# Altium project Graviton.PrjPcb (part 2 of 3)

## Sheet ifamp-rx.SchDoc: RX IF Amp
size Letter; CheckedBy: J. Brinton; CompanyName: Signal Laboratories, Inc.; DrawnBy: J. Brinton; Engineer: J. Brinton; Address1: 3479 Edison Way; Address2: Menlo Park CA 94025; Address3: +1 (877) 778-8435; Address4: siglabs.com; Revision: 3; SheetNumber: 12; SheetTotal: 49
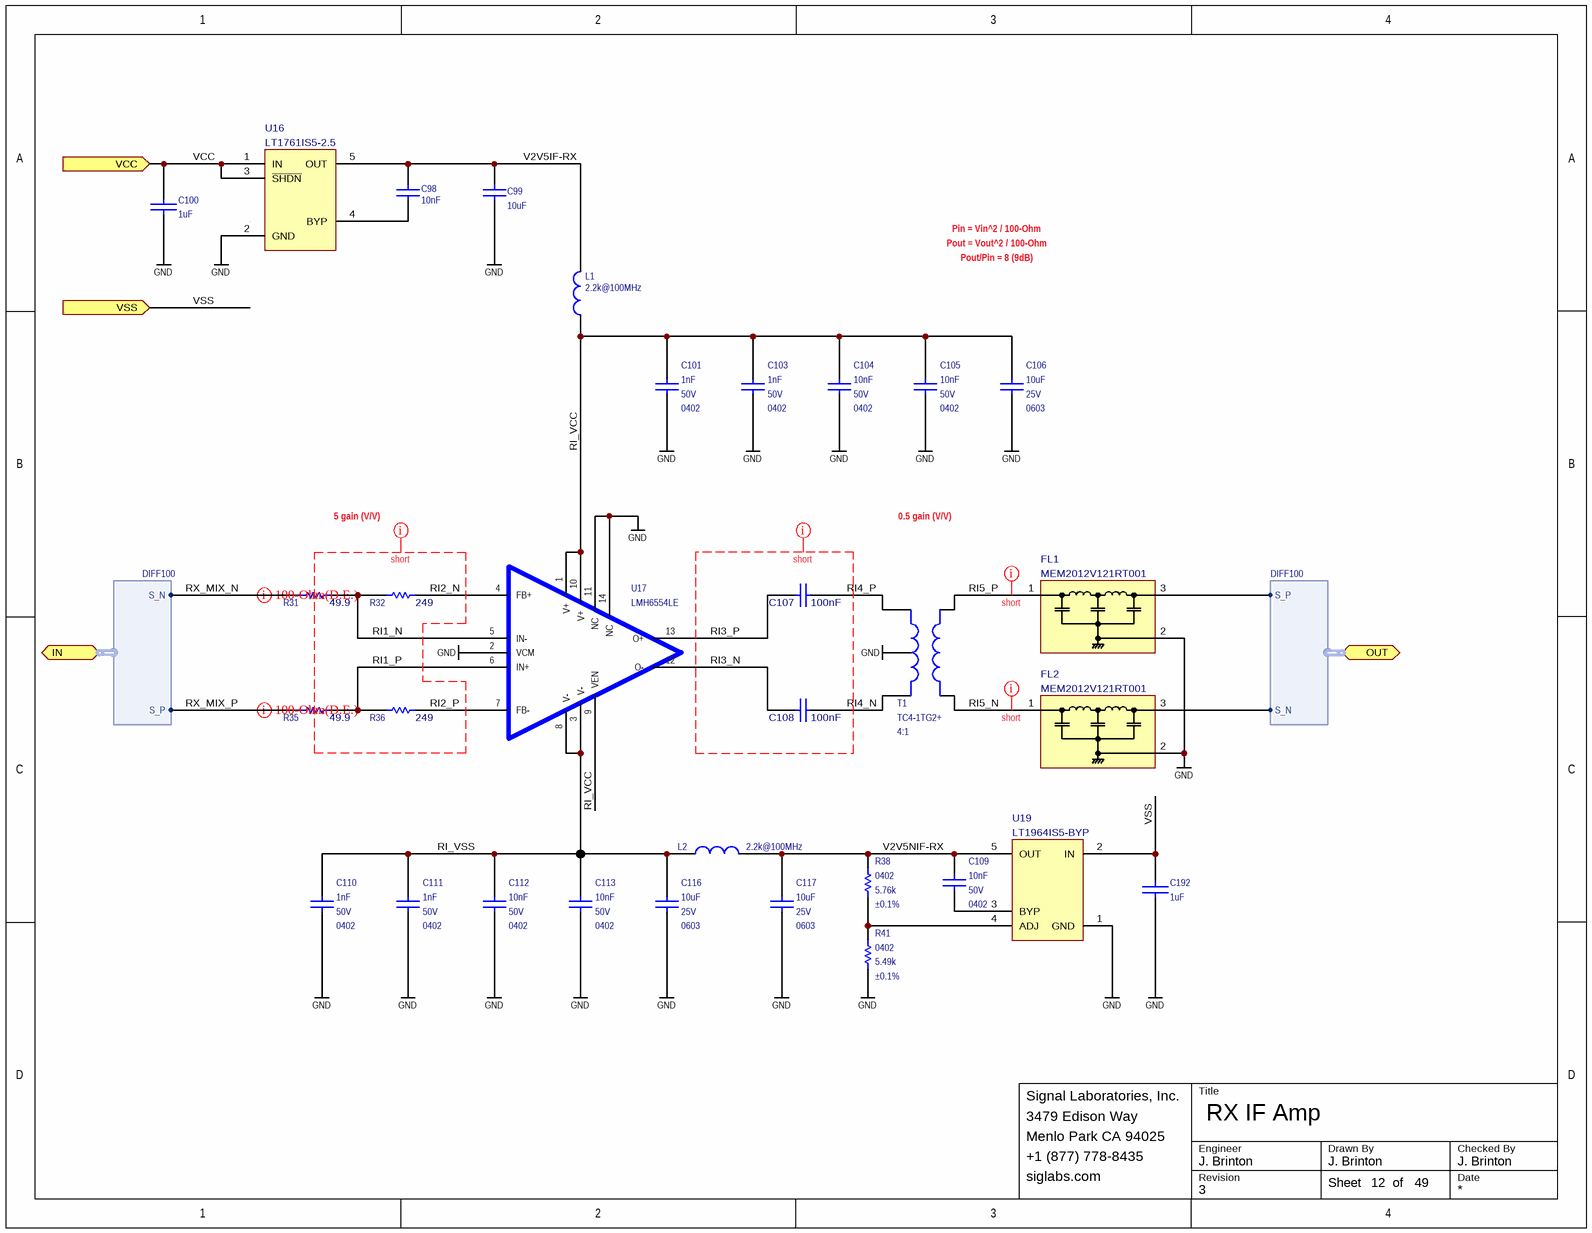
[diagram p7: ifamp-rx.SchDoc]

### Parts
C98  value 10nF  [CAPC100X50X55L25N]  (hidden comment: GRM155R71H103KA88)
C99  value 10uF  [CAPC160X80X90L20N]  (hidden comment: ZRB18AR61E106ME01L)
C100  value 1uF  [CAPC100X50X55L25N]  (hidden comment: GRM155R61A105KE15)
C101  value 1nF  Voltage: 50V  Package: 0402  [CAPC100X50X55L25N]  (hidden comment: CGA2B2NP01H102J050BA)
C103  value 1nF  Voltage: 50V  Package: 0402  [CAPC100X50X55L25N]  (hidden comment: CGA2B2NP01H102J050BA)
C104  value 10nF  Voltage: 50V  Package: 0402  [CAPC100X50X55L25N]  (hidden comment: GRM155R71H103KA88)
C105  value 10nF  Voltage: 50V  Package: 0402  [CAPC100X50X55L25N]  (hidden comment: GRM155R71H103KA88)
C106  value 10uF  Voltage: 25V  Package: 0603  [CAPC160X80X90L20N]  (hidden comment: ZRB18AR61E106ME01L)
C107  value 100nF  [CAPC100X50X55L25N]  (hidden comment: CC0402KRX7R8BB104)
C108  value 100nF  [CAPC100X50X55L25N]  (hidden comment: CC0402KRX7R8BB104)
C109  value 10nF  Voltage: 50V  Package: 0402  [CAPC100X50X55L25N]  (hidden comment: GRM155R71H103KA88)
C110  value 1nF  Voltage: 50V  Package: 0402  [CAPC100X50X55L25N]  (hidden comment: CGA2B2NP01H102J050BA)
C111  value 1nF  Voltage: 50V  Package: 0402  [CAPC100X50X55L25N]  (hidden comment: CGA2B2NP01H102J050BA)
C112  value 10nF  Voltage: 50V  Package: 0402  [CAPC100X50X55L25N]  (hidden comment: GRM155R71H103KA88)
C113  value 10nF  Voltage: 50V  Package: 0402  [CAPC100X50X55L25N]  (hidden comment: GRM155R71H103KA88)
C116  value 10uF  Voltage: 25V  Package: 0603  [CAPC160X80X90L20N]  (hidden comment: ZRB18AR61E106ME01L)
C117  value 10uF  Voltage: 25V  Package: 0603  [CAPC160X80X90L20N]  (hidden comment: ZRB18AR61E106ME01L)
C192  value 1uF  [CAPC100X50X55L25N]  (hidden comment: GRM155R61A105KE15)
FL1  MEM2012V121RT001  [MEM2012V]
FL2  MEM2012V121RT001  [MEM2012V]
L1  value 2.2k@100MHz  [INDC1005X55N]  (hidden comment: MMZ1005A222ET000)
L2  value 2.2k@100MHz  [INDC1005X55N]  (hidden comment: MMZ1005A222ET000)
R31  value 49.9  [RESC1608X55N]  (hidden comment: MCT0603PD4999DP500)
R32  value 249  [RESC1005X40N]  (hidden comment: MCS0402MD2490BE100)
R35  value 49.9  [RESC1608X55N]  (hidden comment: MCT0603PD4999DP500)
R36  value 249  [RESC1005X40N]  (hidden comment: MCS0402MD2490BE100)
R38  value 5.76k  Tolerance: ±0.1%  Package: 0402  [RESC1005X40N]  (hidden comment: RT0402BRE075K76L)
R41  value 5.49k  Tolerance: ±0.1%  Package: 0402  [RESC1005X40N]  (hidden comment: ERA-2AEB5491X)
T1  value 4:1  [AT224-1A]  (hidden comment: TC4-1TG2+)
U16  LT1761IS5-2.5  [TSOT-5]
U17  LMH6554LE  [NHJ0014A]
U19  LT1964IS5-BYP  [SOT23-5]

### Ports
IN (harness DIFF100), OUT (harness DIFF100), VCC (in), VSS (in)

### Harnesses
DIFF100: S_P, S_N

### Nets
GND: C99.1 C100.1 C101.1 C103.1 C104.1 C105.1 C106.1 C110.1 C111.1 C112.1 C113.1 C116.1 C117.1 C192.1 FL1.2(GND) FL2.2(GND) R41.1 T1.2(SecCT) U16.2(GND) U17.2(VCM) U17.11(NC) U17.14(NC) U19.1(GND)
RI1_N: R31.2 R32.1 U17.5(IN-)  [project net RI1_N_12]
RI1_P: R35.2 R36.1 U17.6(IN+)  [project net RI1_P_12]
RI2_N: R32.2 U17.4(FB+)  [project net RI2_N_12]
RI2_P: R36.2 U17.7(FB-)  [project net RI2_P_12]
RI3_N: C108.1 U17.12(O-)  [project net RI3_N_12]
RI3_P: C107.1 U17.13(O+)  [project net RI3_P_12]
RI4_N: C108.2 T1.1(Sec+)  [project net RI4_N_12]
RI4_P: C107.2 T1.3(Sec-)  [project net RI4_P_12]
RI5_N: FL2.1(IN/OUT) T1.6(Pri+)  [project net RI5_N_12]
RI5_P: FL1.1(IN/OUT) T1.4(Pri-)  [project net RI5_P_12]
RI_VCC: C101.2 C103.2 C104.2 C105.2 C106.2 L1.1 U17.1(V+) U17.9(VEN) U17.10(V+)  [project net RI_VCC_12]
RI_VSS: C110.2 C111.2 C112.2 C113.2 C116.2 L2.1 U17.3(V-) U17.8(V-)  [project net RI_VSS_12]
RX_MIX_N: R31.1 ; port IN.S_N
RX_MIX_P: R35.1 ; port IN.S_P
V2V5IF-RX: C98.2 C99.2 L1.2 U16.5(OUT)  [project net V2V5IF-RX_12]
V2V5NIF-RX: C109.2 C117.2 L2.2 R38.2 U19.5(OUT)  [project net V2V5NIF-RX_12]
VCC: C100.2 U16.1(IN) U16.3(~{SHDN}) ; port VCC
VSS: C192.2 U19.2(IN) ; port VSS
NetC98_1: C98.1 U16.4(BYP)
NetC109_1: C109.1 U19.3(BYP)
NetFL1_3: FL1.3(OUT/IN) ; port OUT.S_P
NetFL2_3: FL2.3(OUT/IN) ; port OUT.S_N
NetR38_1: R38.1 R41.2 U19.4(ADJ)

### Layout directives
net class short: RI1_N, RI1_P, RI2_N, RI2_P, RI3_N, RI3_P, RI4_N, RI4_P, RI5_N_12, RI5_P_12
differential pair; net class z100diff12; Name: 100-Ohm(D.E.): RX_MIX_N, RX_MIX_P

### Notes on the sheet
- Pin = Vin^2 / 100-Ohm
- Pout = Vout^2 / 100-Ohm
- Pout/Pin = 8 (9dB)
- 5 gain (V/V)
- 0.5 gain (V/V)
- Title
- Engineer
- Revision
- Drawn By
- Checked By
- Date
- Sheet
- of

### Library data of the parts
C98 C104 C105 C109 C112 C113 = CAP 0402: as C522 on sheet eth; Manufacturer P/N: GRM155R71H103KA88; Tolerance: ±10%
  C98: Voltage: 50V; Package: 0402
C99 C106 C116 C117 = CAP 0603: Ceramic Capacitor 10uF ±20% 25V X5R 0603; Manufacturer: Murata; Tr: -55:85; Manufacturer P/N: ZRB18AR61E106ME01L; Tolerance: ±20%
  C99: Voltage: 25V; Package: 0603
C100 C192 = CAP: Ceramic Capacitor 1uF ±10% 10V X5R 0402; Manufacturer: Murata; Tr: -55:125; Manufacturer P/N: GRM155R61A105KE15; Package: 0402; Tolerance: ±10%; Voltage: 10V
C101 C103 C110 C111 = CAP 0402: as C545 on sheet eth; Manufacturer P/N: CGA2B2NP01H102J050BA; Tolerance: ±5%
C107 C108 = TMK105B7104KV: Ceramic Capacitor 100nF ±10% 25V X7R 0402; Manufacturer: Yageo; Manufacturer P/N: TMK105B7104KV; Tolerance: ±10%; Tr: *; Package: 0402; Voltage: 25V
FL1 FL2 = MEM2012V121RT001: MEM2012 Series 120 MHz 10V 100mA SMT Signal Line 3-Terminal Filter; Manufacturer: TDK; Package: MEM2012V; Manufacturer P/N: MEM2012V121RT001
L1 L2 = INDUCTANCE1: Ferrite Bead 2.2k@100MHz 150mA 0402; Manufacturer: TDK; Tr: -55:125; Manufacturer P/N: MMZ1005A222ET000; Package: 0402
R31 R35 = RES 0603: Thin Film Resistor 49.9 Ohm ±0.5% 0603; Manufacturer: Vishay; Tr: -55:155; Package: 0603; Manufacturer P/N: MCT0603PD4999DP500; Do Not Place: *; Tolerance: ±0.5%
R32 R36 = RES 0603: Thin Film Resistor 249 Ohm ±0.1% 0402; Manufacturer: Vishay; Tr: -55:155; Package: 0402; Manufacturer P/N: MCS0402MD2490BE100; Do Not Place: *; Tolerance: ±0.1%
R38 = RES: Thin Film Resistor 5.76k +/-0.1% SMD 0402; Manufacturer: Yageo; Tr: -55:155; Tcr: *; Manufacturer P/N: RT0402BRE075K76L; Alternatives: *; Voltage: *; Power: *
R41 = RES: Thin Film Resistor 5.49k +/-0.1% SMD 0402; Manufacturer: Panasonic; Tr: -55:155; Tcr: *; Manufacturer P/N: ERA-2AEB5491X; Alternatives: *; Voltage: *; Power: *
T1 = TC1-1TG2+: RF Transformer 0.5 to 300MHz SMD; Manufacturer: Mini-Circuits; Manufacturer P/N: TC4-1TG2+
U16 = LT1761IS5-5: 100mA Low Noise LDO 5V; Manufacturer: Linear Technology; Manufacturer P/N: LT1761IS5-5
U17 = LMH6554LE: 2.8 GHz Ultra Linear Fully Differential Amplifier; Manufacturer: Texas Instruments; Manufacturer P/N: LMH6554LE
U19 = LT1964IS5-BYP: 200mA Low Noise negative-LDO; Manufacturer: Linear Technology; Manufacturer P/N: LT1964IS5-BYP

## Sheet dac.SchDoc: DAC
size Letter; CheckedBy: J. Brinton; CompanyName: Signal Laboratories, Inc.; DrawnBy: J. Brinton; Engineer: J. Brinton; Address1: 3479 Edison Way; Address2: Menlo Park CA 94025; Address3: +1 (877) 778-8435; Address4: siglabs.com; Revision: 3; SheetNumber: 24; SheetTotal: 49; ModifiedDate: 4/20/2018
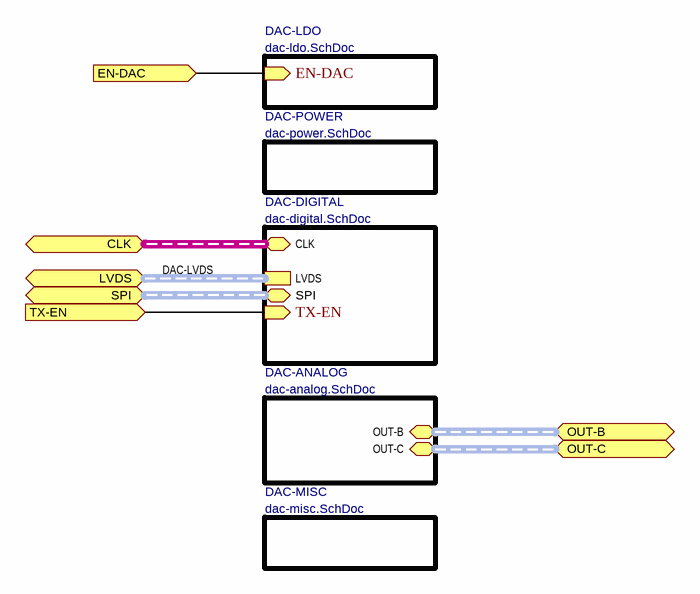
[diagram p8: dac.SchDoc]

### Sub-sheets
DAC-ANALOG = dac-analog.SchDoc: OUT-B (harness DIFF100), OUT-C (harness DIFF100)
DAC-DIGITAL = dac-digital.SchDoc: LVDS (harness DAC-LVDS), CLK (harness CLK-LVPECL33-TERM), SPI (harness SPI-3V3), TX-EN (in)
DAC-LDO = dac-ldo.SchDoc: EN-DAC (in)
DAC-MISC = dac-misc.SchDoc: no entries
DAC-POWER = dac-power.SchDoc: no entries

### Ports
CLK (harness CLK-LVPECL33-TERM), EN-DAC (in), LVDS (harness DAC-LVDS), OUT-B (harness DIFF100), OUT-C (harness DIFF100), SPI (harness SPI-3V3), TX-EN (in)

### Nets
EN-DAC: port EN-DAC, sheet DAC-LDO/EN-DAC
NetTP4_1: port TX-EN, sheet DAC-DIGITAL/TX-EN

### Buses and harness runs
harness DAC-LVDS = port LVDS = sheet DAC-DIGITAL/LVDS
harness port CLK = sheet DAC-DIGITAL/CLK
harness port OUT-B = sheet DAC-ANALOG/OUT-B
harness port OUT-C = sheet DAC-ANALOG/OUT-C
harness port SPI = sheet DAC-DIGITAL/SPI

### Notes on the sheet
- Title
- Engineer
- Revision
- Drawn By
- Checked By
- Date
- Sheet
- of

## Sheet dac-digital.SchDoc: DAC - Digital
size Letter; CheckedBy: J. Brinton; CompanyName: Signal Laboratories, Inc.; DrawnBy: J. Brinton; Engineer: J. Brinton; Address1: 3479 Edison Way; Address2: Menlo Park CA 94025; Address3: +1 (877) 778-8435; Address4: siglabs.com; Revision: 3; SheetNumber: 25; SheetTotal: 49
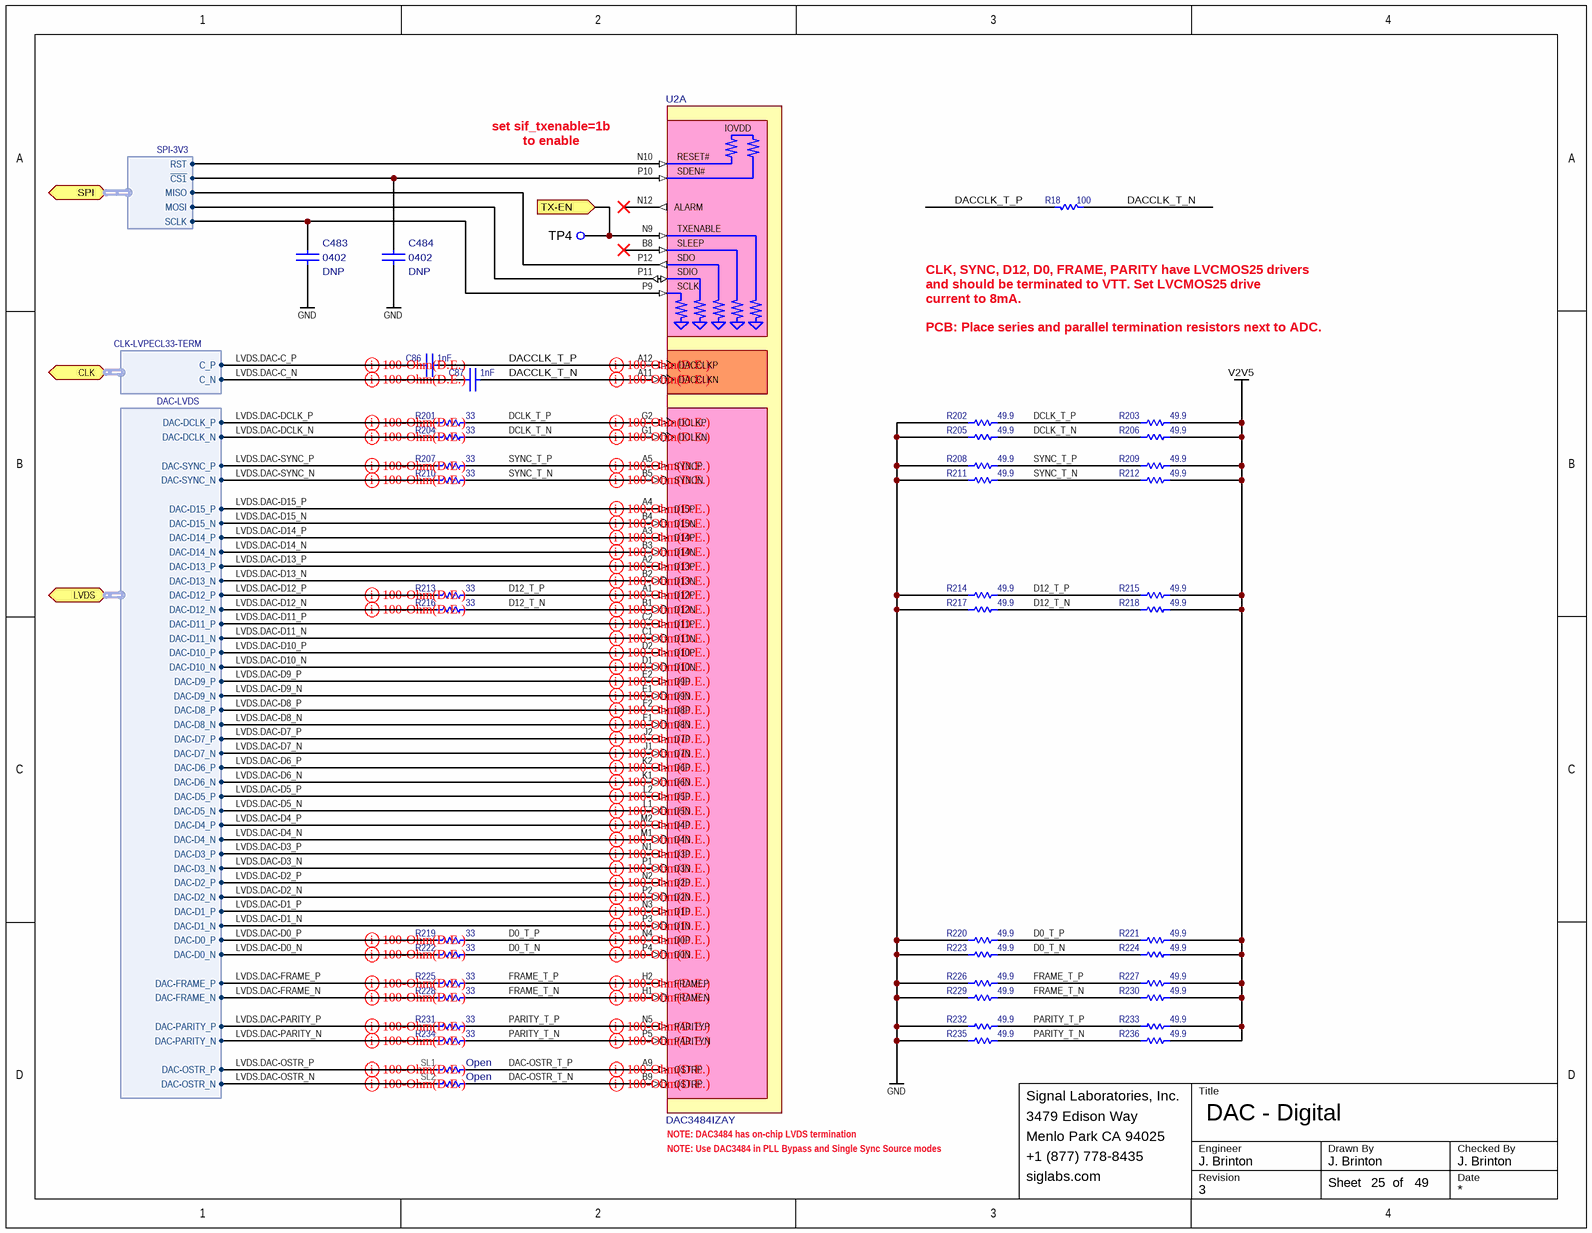
[diagram p9: dac-digital.SchDoc]

### Parts
C86  value 1nF  [CAPC100X50X55L25N]  (hidden comment: CGA2B2NP01H102J050BA)
C87  value 1nF  [CAPC100X50X55L25N]  (hidden comment: CGA2B2NP01H102J050BA)
C483  Package: 0402  Do Not Place: DNP  [CAPC100X50X55L25N]  (hidden comment: VJ0402A101KXA)
C484  Package: 0402  Do Not Place: DNP  [CAPC100X50X55L25N]  (hidden comment: VJ0402A101KXA)
R18  value 100  [RESC1005X40N]  (hidden comment: ERA-2AEB101X)
R201  value 33  [RESC1005X40N]  (hidden comment: MCS04020C3309FE000)
R202  value 49.9  [RESC1005X40N]  (hidden comment: MCS04020C4999FE000)
R203  value 49.9  [RESC1005X40N]  (hidden comment: MCS04020C4999FE000)
R204  value 33  [RESC1005X40N]  (hidden comment: MCS04020C3309FE000)
R205  value 49.9  [RESC1005X40N]  (hidden comment: MCS04020C4999FE000)
R206  value 49.9  [RESC1005X40N]  (hidden comment: MCS04020C4999FE000)
R207  value 33  [RESC1005X40N]  (hidden comment: MCS04020C3309FE000)
R208  value 49.9  [RESC1005X40N]  (hidden comment: MCS04020C4999FE000)
R209  value 49.9  [RESC1005X40N]  (hidden comment: MCS04020C4999FE000)
R210  value 33  [RESC1005X40N]  (hidden comment: MCS04020C3309FE000)
R211  value 49.9  [RESC1005X40N]  (hidden comment: MCS04020C4999FE000)
R212  value 49.9  [RESC1005X40N]  (hidden comment: MCS04020C4999FE000)
R213  value 33  [RESC1005X40N]  (hidden comment: MCS04020C3309FE000)
R214  value 49.9  [RESC1005X40N]  (hidden comment: MCS04020C4999FE000)
R215  value 49.9  [RESC1005X40N]  (hidden comment: MCS04020C4999FE000)
R216  value 33  [RESC1005X40N]  (hidden comment: MCS04020C3309FE000)
R217  value 49.9  [RESC1005X40N]  (hidden comment: MCS04020C4999FE000)
R218  value 49.9  [RESC1005X40N]  (hidden comment: MCS04020C4999FE000)
R219  value 33  [RESC1005X40N]  (hidden comment: MCS04020C3309FE000)
R220  value 49.9  [RESC1005X40N]  (hidden comment: MCS04020C4999FE000)
R221  value 49.9  [RESC1005X40N]  (hidden comment: MCS04020C4999FE000)
R222  value 33  [RESC1005X40N]  (hidden comment: MCS04020C3309FE000)
R223  value 49.9  [RESC1005X40N]  (hidden comment: MCS04020C4999FE000)
R224  value 49.9  [RESC1005X40N]  (hidden comment: MCS04020C4999FE000)
R225  value 33  [RESC1005X40N]  (hidden comment: MCS04020C3309FE000)
R226  value 49.9  [RESC1005X40N]  (hidden comment: MCS04020C4999FE000)
R227  value 49.9  [RESC1005X40N]  (hidden comment: MCS04020C4999FE000)
R228  value 33  [RESC1005X40N]  (hidden comment: MCS04020C3309FE000)
R229  value 49.9  [RESC1005X40N]  (hidden comment: MCS04020C4999FE000)
R230  value 49.9  [RESC1005X40N]  (hidden comment: MCS04020C4999FE000)
R231  value 33  [RESC1005X40N]  (hidden comment: MCS04020C3309FE000)
R232  value 49.9  [RESC1005X40N]  (hidden comment: MCS04020C4999FE000)
R233  value 49.9  [RESC1005X40N]  (hidden comment: MCS04020C4999FE000)
R234  value 33  [RESC1005X40N]  (hidden comment: MCS04020C3309FE000)
R235  value 49.9  [RESC1005X40N]  (hidden comment: MCS04020C4999FE000)
R236  value 49.9  [RESC1005X40N]  (hidden comment: MCS04020C4999FE000)
SL1  Notes: Open  [SOLDERLINK0603X26N]  (hidden comment: SOLDER_LINK)  (no BOM)
SL2  Notes: Open  [SOLDERLINK0603X26N]  (hidden comment: SOLDER_LINK)  (no BOM)
TP4  TEST_POINT_SMD_10  [TEST_POINT_SMD_10]  (value not drawn)  (no BOM)
U2  DAC3484IZAY  [ZAY-BGA-196]  (part A of 5)

### Ports
CLK (harness CLK-LVPECL33-TERM), LVDS (harness DAC-LVDS), SPI (harness SPI-3V3), TX-EN (in)

### Harnesses
DAC-LVDS: DAC-D0_P, DAC-D0_N, DAC-D1_P, DAC-D1_N, DAC-D2_P, DAC-D2_N, DAC-D3_P, DAC-D3_N, DAC-D4_P, DAC-D4_N, DAC-D5_P, DAC-D5_N, DAC-D6_P, DAC-D6_N, DAC-D7_P, DAC-D7_N, DAC-D8_P, DAC-D8_N, DAC-D9_P, DAC-D9_N, DAC-D10_P, DAC-D10_N, DAC-D11_P, DAC-D11_N, DAC-D12_P, DAC-D12_N, DAC-D13_P, DAC-D13_N, DAC-D14_P, DAC-D14_N, DAC-D15_P, DAC-D15_N, DAC-DCLK_P, DAC-DCLK_N, DAC-SYNC_P, DAC-SYNC_N, DAC-PARITY_P, DAC-PARITY_N, DAC-FRAME_P, DAC-FRAME_N, DAC-OSTR_P, DAC-OSTR_N
CLK-LVPECL33-TERM: C_P, C_N
SPI-3V3: MOSI, MISO, SCLK, ~{CS1}, RST

### Nets
GND: C483.2 C484.2 R202.2 R205.2 R208.2 R211.2 R214.2 R217.2 R220.2 R223.2 R226.2 R229.2 R232.2 R235.2
V2V5: R203.1 R206.1 R209.1 R212.1 R215.1 R218.1 R221.1 R224.1 R227.1 R230.1 R233.1 R236.1
D0_T_N: R222.1 R223.1 R224.2 U2.P4(D0N)  [project net D0_T_N_25]
D0_T_P: R219.1 R220.1 R221.2 U2.N4(D0P)  [project net D0_T_P_25]
D12_T_N: R216.1 R217.1 R218.2 U2.B1(D12N)  [project net D12_T_N_25]
D12_T_P: R213.1 R214.1 R215.2 U2.A1(D12P)  [project net D12_T_P_25]
DAC-OSTR_T_N: SL2.1 U2.B9(OSTRP)  [project net DAC-OSTR_T_N_25]
DAC-OSTR_T_P: SL1.1 U2.A9(OSTRP)  [project net DAC-OSTR_T_P_25]
DACCLK_T_N: C87.1 R18.2 U2.A11(DACCLKN)  [project net DACCLK_T_N_25]
DACCLK_T_P: C86.1 R18.1 U2.A12(DACCLKP)  [project net DACCLK_T_P_25]
DCLK_T_N: R204.1 R205.1 R206.2 U2.G1(DCLKN)  [project net DCLK_T_N_25]
DCLK_T_P: R201.1 R202.1 R203.2 U2.G2(DCLKP)  [project net DCLK_T_P_25]
FRAME_T_N: R228.1 R229.1 R230.2 U2.H1(FRAMEN)  [project net FRAME_T_N_25]
FRAME_T_P: R225.1 R226.1 R227.2 U2.H2(FRAMEP)  [project net FRAME_T_P_25]
LVDS.DAC-C_N: C87.2 ; port CLK.C_N
LVDS.DAC-C_P: C86.2 ; port CLK.C_P
LVDS.DAC-D0_N: R222.2 ; port LVDS.DAC-D0_N  [project net DAC-LVDS.DAC-D0_N]
LVDS.DAC-D0_P: R219.2 ; port LVDS.DAC-D0_P  [project net DAC-LVDS.DAC-D0_P]
LVDS.DAC-D1_N: U2.P3(D1N) ; port LVDS.DAC-D1_N  [project net DAC-LVDS.DAC-D1_N]
LVDS.DAC-D1_P: U2.N3(D1P) ; port LVDS.DAC-D1_P  [project net DAC-LVDS.DAC-D1_P]
LVDS.DAC-D2_N: U2.P2(D2N) ; port LVDS.DAC-D2_N  [project net DAC-LVDS.DAC-D2_N]
LVDS.DAC-D2_P: U2.N2(D2P) ; port LVDS.DAC-D2_P  [project net DAC-LVDS.DAC-D2_P]
LVDS.DAC-D3_N: U2.P1(D3N) ; port LVDS.DAC-D3_N  [project net DAC-LVDS.DAC-D3_N]
LVDS.DAC-D3_P: U2.N1(D3P) ; port LVDS.DAC-D3_P  [project net DAC-LVDS.DAC-D3_P]
LVDS.DAC-D4_N: U2.M1(D4N) ; port LVDS.DAC-D4_N  [project net DAC-LVDS.DAC-D4_N]
LVDS.DAC-D4_P: U2.M2(D4P) ; port LVDS.DAC-D4_P  [project net DAC-LVDS.DAC-D4_P]
LVDS.DAC-D5_N: U2.L1(D5N) ; port LVDS.DAC-D5_N  [project net DAC-LVDS.DAC-D5_N]
LVDS.DAC-D5_P: U2.L2(D5P) ; port LVDS.DAC-D5_P  [project net DAC-LVDS.DAC-D5_P]
LVDS.DAC-D6_N: U2.K1(D6N) ; port LVDS.DAC-D6_N  [project net DAC-LVDS.DAC-D6_N]
LVDS.DAC-D6_P: U2.K2(D6P) ; port LVDS.DAC-D6_P  [project net DAC-LVDS.DAC-D6_P]
LVDS.DAC-D7_N: U2.J1(D7N) ; port LVDS.DAC-D7_N  [project net DAC-LVDS.DAC-D7_N]
LVDS.DAC-D7_P: U2.J2(D7P) ; port LVDS.DAC-D7_P  [project net DAC-LVDS.DAC-D7_P]
LVDS.DAC-D8_N: U2.F1(D8N) ; port LVDS.DAC-D8_N  [project net DAC-LVDS.DAC-D8_N]
LVDS.DAC-D8_P: U2.F2(D8P) ; port LVDS.DAC-D8_P  [project net DAC-LVDS.DAC-D8_P]
LVDS.DAC-D9_N: U2.E1(D9N) ; port LVDS.DAC-D9_N  [project net DAC-LVDS.DAC-D9_N]
LVDS.DAC-D9_P: U2.E2(D9P) ; port LVDS.DAC-D9_P  [project net DAC-LVDS.DAC-D9_P]
LVDS.DAC-D10_N: U2.D1(D10N) ; port LVDS.DAC-D10_N  [project net DAC-LVDS.DAC-D10_N]
LVDS.DAC-D10_P: U2.D2(D10P) ; port LVDS.DAC-D10_P  [project net DAC-LVDS.DAC-D10_P]
LVDS.DAC-D11_N: U2.C1(D11N) ; port LVDS.DAC-D11_N  [project net DAC-LVDS.DAC-D11_N]
LVDS.DAC-D11_P: U2.C2(D11P) ; port LVDS.DAC-D11_P  [project net DAC-LVDS.DAC-D11_P]
LVDS.DAC-D12_N: R216.2 ; port LVDS.DAC-D12_N  [project net DAC-LVDS.DAC-D12_N]
LVDS.DAC-D12_P: R213.2 ; port LVDS.DAC-D12_P  [project net DAC-LVDS.DAC-D12_P]
LVDS.DAC-D13_N: U2.B2(D13N) ; port LVDS.DAC-D13_N  [project net DAC-LVDS.DAC-D13_N]
LVDS.DAC-D13_P: U2.A2(D13P) ; port LVDS.DAC-D13_P  [project net DAC-LVDS.DAC-D13_P]
LVDS.DAC-D14_N: U2.B3(D14N) ; port LVDS.DAC-D14_N  [project net DAC-LVDS.DAC-D14_N]
LVDS.DAC-D14_P: U2.A3(D14P) ; port LVDS.DAC-D14_P  [project net DAC-LVDS.DAC-D14_P]
LVDS.DAC-D15_N: U2.B4(D15N) ; port LVDS.DAC-D15_N  [project net DAC-LVDS.DAC-D15_N]
LVDS.DAC-D15_P: U2.A4(D15P) ; port LVDS.DAC-D15_P  [project net DAC-LVDS.DAC-D15_P]
LVDS.DAC-DCLK_N: R204.2 ; port LVDS.DAC-DCLK_N  [project net DAC-LVDS.DAC-DCLK_N]
LVDS.DAC-DCLK_P: R201.2 ; port LVDS.DAC-DCLK_P  [project net DAC-LVDS.DAC-DCLK_P]
LVDS.DAC-FRAME_N: R228.2 ; port LVDS.DAC-FRAME_N  [project net DAC-LVDS.DAC-FRAME_N]
LVDS.DAC-FRAME_P: R225.2 ; port LVDS.DAC-FRAME_P  [project net DAC-LVDS.DAC-FRAME_P]
LVDS.DAC-OSTR_N: SL2.2 ; port LVDS.DAC-OSTR_N  [project net DAC-LVDS.DAC-OSTR_N]
LVDS.DAC-OSTR_P: SL1.2 ; port LVDS.DAC-OSTR_P  [project net DAC-LVDS.DAC-OSTR_P]
LVDS.DAC-PARITY_N: R234.2 ; port LVDS.DAC-PARITY_N  [project net DAC-LVDS.DAC-PARITY_N]
LVDS.DAC-PARITY_P: R231.2 ; port LVDS.DAC-PARITY_P  [project net DAC-LVDS.DAC-PARITY_P]
LVDS.DAC-SYNC_N: R210.2 ; port LVDS.DAC-SYNC_N  [project net DAC-LVDS.DAC-SYNC_N]
LVDS.DAC-SYNC_P: R207.2 ; port LVDS.DAC-SYNC_P  [project net DAC-LVDS.DAC-SYNC_P]
PARITY_T_N: R234.1 R235.1 R236.2 U2.P5(PARITYN)  [project net PARITY_T_N_25]
PARITY_T_P: R231.1 R232.1 R233.2 U2.N5(PARITYP)  [project net PARITY_T_P_25]
SYNC_T_N: R210.1 R211.1 R212.2 U2.B5(SYNCN)  [project net SYNC_T_N_25]
SYNC_T_P: R207.1 R208.1 R209.2 U2.A5(SYNCP)  [project net SYNC_T_P_25]
NetC483_1: C483.1 U2.P9(SCLK) ; port SPI.SCLK
NetC484_1: C484.1 U2.P10(~{SDEN}) ; port SPI.~{CS1}
NetTP4_1: TP4.1 U2.N9(TXENABLE) ; port TX-EN
NetU2_N10: U2.N10(~{RESET}) ; port SPI.RST
NetU2_P11: U2.P11(SDIO) ; port SPI.MOSI
NetU2_P12: U2.P12(SDO) ; port SPI.MISO

Not connected (* = marked no-connect by the designer): U2 B8(SLEEP)* N12(ALARM)*

### Layout directives
differential pair; net class z100diff12; Name: 100-Ohm(D.E.): D0_T_N_25, D0_T_P_25, D12_T_N_25, D12_T_P_25, DAC-LVDS.DAC-D13_N, DAC-LVDS.DAC-D13_P, DAC-LVDS.DAC-D14_N, DAC-LVDS.DAC-D14_P, DAC-LVDS.DAC-D15_N, DAC-LVDS.DAC-D15_P, DAC-OSTR_T_N_25, DAC-OSTR_T_P_25, DACCLK_T_N_25, DACCLK_T_P_25, DCLK_T_N_25, DCLK_T_P_25, FRAME_T_N_25, FRAME_T_P_25, LVDS.DAC-C_N, LVDS.DAC-C_P, PARITY_T_N_25, PARITY_T_P_25, SYNC_T_N_25, SYNC_T_P_25
differential pair; net class z100diff12; Name: 100-Ohm(D.E.); net class dac: DAC-LVDS.DAC-D0_N, DAC-LVDS.DAC-D0_P, DAC-LVDS.DAC-D1_N, DAC-LVDS.DAC-D1_P, DAC-LVDS.DAC-D2_N, DAC-LVDS.DAC-D2_P, DAC-LVDS.DAC-D3_N, DAC-LVDS.DAC-D3_P, DAC-LVDS.DAC-D4_N, DAC-LVDS.DAC-D4_P, DAC-LVDS.DAC-D5_N, DAC-LVDS.DAC-D5_P, DAC-LVDS.DAC-D6_N, DAC-LVDS.DAC-D6_P, DAC-LVDS.DAC-D7_N, DAC-LVDS.DAC-D7_P, DAC-LVDS.DAC-D8_N, DAC-LVDS.DAC-D8_P, DAC-LVDS.DAC-D9_N, DAC-LVDS.DAC-D9_P, DAC-LVDS.DAC-D10_N, DAC-LVDS.DAC-D10_P, DAC-LVDS.DAC-D11_N, DAC-LVDS.DAC-D11_P, DAC-LVDS.DAC-D12_N, DAC-LVDS.DAC-D12_P, DAC-LVDS.DAC-DCLK_N, DAC-LVDS.DAC-DCLK_P, DAC-LVDS.DAC-FRAME_N, DAC-LVDS.DAC-FRAME_P, DAC-LVDS.DAC-OSTR_N, DAC-LVDS.DAC-OSTR_P, DAC-LVDS.DAC-PARITY_N, DAC-LVDS.DAC-PARITY_P, DAC-LVDS.DAC-SYNC_N, DAC-LVDS.DAC-SYNC_P

### Notes on the sheet
- set sif_txenable=1b
- to enable
- CLK, SYNC, D12, D0, FRAME, PARITY have LVCMOS25 drivers
- and should be terminated to VTT. Set LVCMOS25 drive
- current to 8mA.
- PCB: Place series and parallel termination resistors next to ADC.
- (near U2) NOTE: DAC3484 has on-chip LVDS termination
- NOTE: Use DAC3484 in PLL Bypass and Single Sync Source modes
- Title
- Engineer
- Revision
- Drawn By
- Checked By
- Date
- Sheet
- of
- (in symbol DAC3484IZAY, part A) RESET#; SDEN#

### Library data of the parts
C86 C87 = CAP 0402: Ceramic Capacitor 1nF ±5% 50V NP0 0402; Manufacturer: TDK; Tr: -55:150; Voltage: 50V; Manufacturer P/N: CGA2B2NP01H102J050BA; Package: 0402; Tolerance: ±5%
C483 C484 = VJ0402A101JXA: Ceramic Capacitor 100pF ±10% 50V C0G 0402; Manufacturer: Vishay; Tr: -55:150; Manufacturer P/N: VJ0402A101KXA; Tolerance: ±10%; Value: 100pF; Voltage: 50V
R18 = RES 0402: Thin Film Resistor 100 ±0.1% 0402; Manufacturer: Panasonic; Tr: -55:155; Package: 0402; Manufacturer P/N: ERA-2AEB101X; Tolerance: ±0.1%
R201 R204 R207 R210 R213 R216 R219 R222 R225 R228 R231 R234 = RES 0603: Thin Film Resistor 33 Ohm ±1% 0402; Manufacturer: Vishay; Tr: -55:150; Package: 0402; Manufacturer P/N: MCS04020C3309FE000; Do Not Place: *; Tolerance: ±1%
R202 R203 R205 R206 R208 R209 R211 R212 R214 R215 R217 R218 R220 R221 R223 R224 R226 R227 R229 R230 R232 R233 R235 R236 = RES 0603: Thin Film Resistor 49.9 Ohm ±1% 0402; Manufacturer: Vishay; Tr: -55:150; Package: 0402; Manufacturer P/N: MCS04020C4999FE000; Do Not Place: *; Tolerance: ±1%
SL1 SL2 = RES: Solder Link, Open
TP4 = TEST_POINT_SMD_10: Test Point SMD
U2 = DAC3484IZAY: High Speed Quad DAC, 16-bit, 1.25GSPS; Manufacturer: Texas Instruments; Manufacturer P/N: DAC3484IZAY

## Sheet dac-analog.SchDoc: DAC - Analog
size Letter; CheckedBy: J. Brinton; CompanyName: Signal Laboratories, Inc.; DrawnBy: J. Brinton; Engineer: J. Brinton; Address1: 3479 Edison Way; Address2: Menlo Park CA 94025; Address3: +1 (877) 778-8435; Address4: siglabs.com; Revision: 3; SheetNumber: 26; SheetTotal: 49; ModifiedDate: 4/20/2018
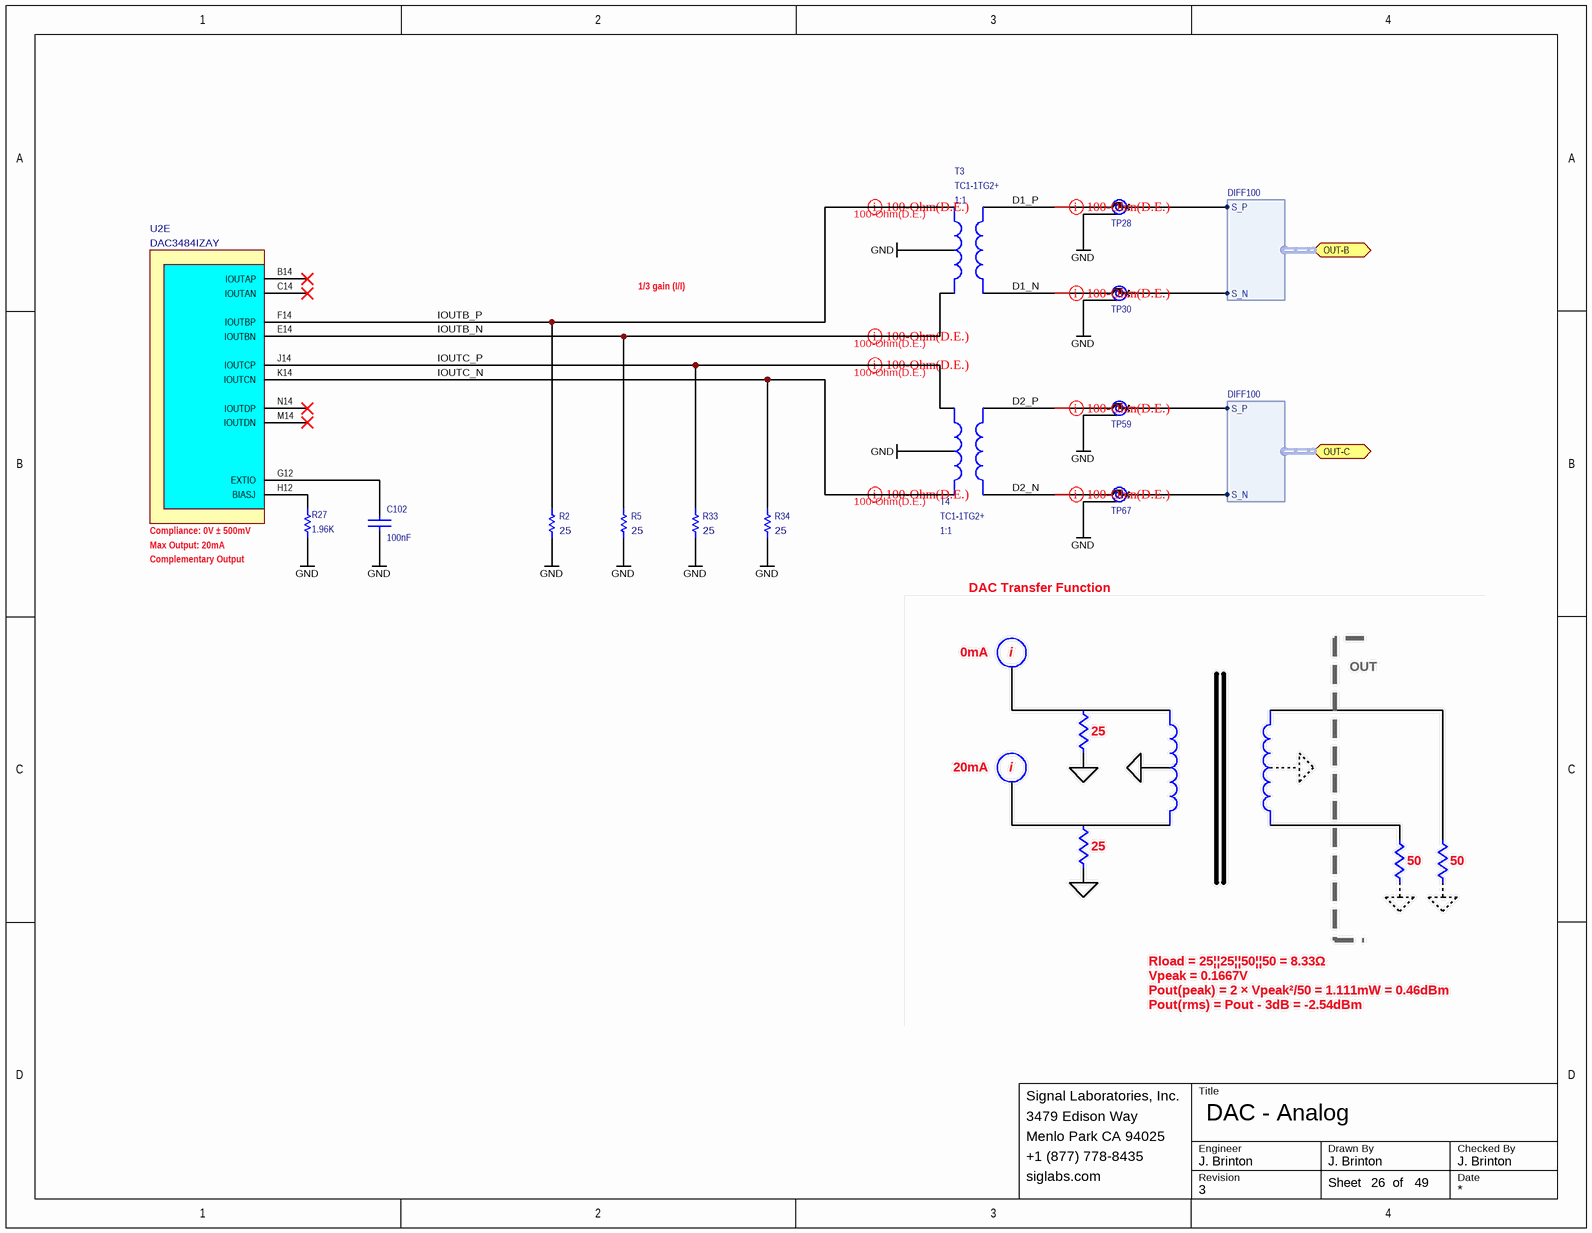
[diagram p10: dac-analog.SchDoc]

### Parts
C102  value 100nF  [CAPC100X50X55L25N]  (hidden comment: GRM155R71C104KA88J)
R2  value 25  [RESC1005X40N]  (hidden comment: FC0402E25R0BST0)
R5  value 25  [RESC1005X40N]  (hidden comment: FC0402E25R0BST0)
R27  value 1.96K  [RESC1005X40N]  (hidden comment: ERA-2AEB1961X)
R33  value 25  [RESC1005X40N]  (hidden comment: FC0402E25R0BST0)
R34  value 25  [RESC1005X40N]  (hidden comment: FC0402E25R0BST0)
T3  value 1:1  [AT224-1A]  (hidden comment: TC1-1TG2+)
T4  value 1:1  [AT224-1A]  (hidden comment: TC1-1TG2+)
TP28  MS-180(20)  [MS-180(20)]  (value not drawn)
TP30  MS-180(20)  [MS-180(20)]  (value not drawn)
TP59  MS-180(20)  [MS-180(20)]  (value not drawn)
TP67  MS-180(20)  [MS-180(20)]  (value not drawn)
U2  DAC3484IZAY  [ZAY-BGA-196]  (part E of 5)

### Ports
OUT-B (harness DIFF100), OUT-C (harness DIFF100)

### Harnesses
DIFF100: S_P, S_N

### Nets
GND: C102.1 R2.1 R5.1 R27.1 R33.1 R34.1 T3.2(SecCT) T4.2(SecCT) TP28.G(GND) TP30.G(GND) TP59.G(GND) TP67.G(GND)
D1_N: T3.4(Pri-) TP30.A(OUT)  [project net D1_N_26]
D1_P: T3.6(Pri+) TP28.A(OUT)  [project net D1_P_26]
D2_N: T4.6(Pri+) TP67.A(OUT)  [project net D2_N_26]
D2_P: T4.4(Pri-) TP59.A(OUT)  [project net D2_P_26]
IOUTB_N: R5.2 T3.3(Sec-) U2.E14(IOUTBN)  [project net IOUTB_N_26]
IOUTB_P: R2.2 T3.1(Sec+) U2.F14(IOUTBP)  [project net IOUTB_P_26]
IOUTC_N: R34.2 T4.1(Sec+) U2.K14(IOUTCN)  [project net IOUTC_N_26]
IOUTC_P: R33.2 T4.3(Sec-) U2.J14(IOUTCP)  [project net IOUTC_P_26]
NetC102_2: C102.2 U2.G12(EXTIO)
NetR27_2: R27.2 U2.H12(BIASJ)
NetTP28_C: TP28.C(IN) ; port OUT-B.S_P
NetTP30_C: TP30.C(IN) ; port OUT-B.S_N
NetTP59_C: TP59.C(IN) ; port OUT-C.S_P
NetTP67_C: TP67.C(IN) ; port OUT-C.S_N

Not connected (* = marked no-connect by the designer): U2 B14(IOUTAP)* C14(IOUTAN)* M14(IOUTDN)* N14(IOUTDP)*

### Layout directives
differential pair; net class z100diff12; Name: 100-Ohm(D.E.): IOUTB_N_26, IOUTB_P_26, IOUTC_N_26, IOUTC_P_26
differential pair; net class z100diff12; Name: 100-Ohm(D.E.); net class rf: D1_N_26, D1_P_26, D2_N_26, D2_P_26

### Notes on the sheet
- 1/3 gain (I/I)
- Compliance: 0V ± 500mV
- Max Output: 20mA
- Complementary Output
- DAC Transfer Function
- 0mA
- i
- OUT
- 25
- 20mA
- 50
- Rload = 25||25||50||50 = 8.33Ω
- Vpeak = 0.1667V
- Pout(peak) = 2 × Vpeak²/50 = 1.111mW = 0.46dBm
- Pout(rms) = Pout - 3dB = -2.54dBm
- Title
- Engineer
- Revision
- Drawn By
- Checked By
- Date
- Sheet
- of

### Library data of the parts
C102 = CAP 0402: Ceramic Capacitor 100nF ±10% 16V X7R 0402; Manufacturer: Murata; Tr: -55:125; Voltage: 16V; Manufacturer P/N: GRM155R71C104KA88J; Package: 0402; Tolerance: ±10%
R2 R5 R33 R34 = RES 0603: Thin Film Resistor 25 Ohm ±0.1% 0402; Manufacturer: Vishay; Tr: -55:155; Package: 0402; Manufacturer P/N: FC0402E25R0BST0; Do Not Place: *; Tolerance: ±0.1%
R27 = RES 0402: Thin Film Resistor 1.96k ±0.1% 0402; Manufacturer: Panasonic; Tr: -55:155; Package: 0402; Manufacturer P/N: ERA-2AEB1961X; Tolerance: ±0.1%
T3 T4 = TC1-1TG2+: RF Transformer 0.4 to 500MHz SMD; Manufacturer: Mini-Circuits; Manufacturer P/N: TC1-1TG2+
TP28 TP30 TP59 TP67 = MS-180(20): Coaxial Connector Switch; Manufacturer: Hirose; Manufacturer P/N: MS-180(20)
U2 = DAC3484IZAY: as U2 on sheet dac-digital; Manufacturer P/N: DAC3484IZAY

## Sheet dac-power.SchDoc: DAC - Power
size Letter; CheckedBy: J. Brinton; CompanyName: Signal Laboratories, Inc.; DrawnBy: J. Brinton; Engineer: J. Brinton; Address1: 3479 Edison Way; Address2: Menlo Park CA 94025; Address3: +1 (877) 778-8435; Address4: siglabs.com; Revision: 3; SheetNumber: 27; SheetTotal: 49
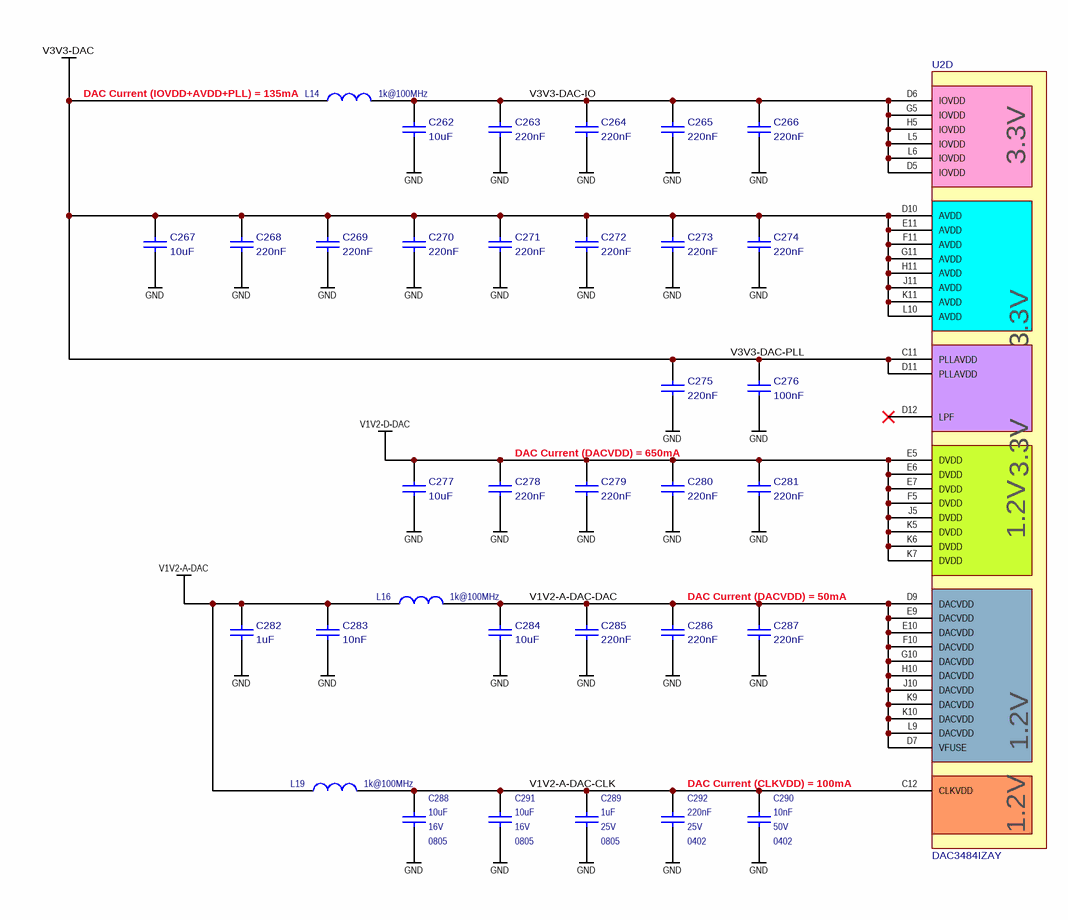
[diagram p11: dac-power.SchDoc]

### Parts
C262  value 10uF  [CAPC200X125X145L45N]  (hidden comment: CL21B106KOQNNNE)
C263  value 220nF  [CAPC100X50X55L25N]  (hidden comment: C1005X7R1E224K050BE)
C264  value 220nF  [CAPC100X50X55L25N]  (hidden comment: C1005X7R1E224K050BE)
C265  value 220nF  [CAPC100X50X55L25N]  (hidden comment: C1005X7R1E224K050BE)
C266  value 220nF  [CAPC100X50X55L25N]  (hidden comment: C1005X7R1E224K050BE)
C267  value 10uF  [CAPC200X125X145L45N]  (hidden comment: CL21B106KOQNNNE)
C268  value 220nF  [CAPC100X50X55L25N]  (hidden comment: C1005X7R1E224K050BE)
C269  value 220nF  [CAPC100X50X55L25N]  (hidden comment: C1005X7R1E224K050BE)
C270  value 220nF  [CAPC100X50X55L25N]  (hidden comment: C1005X7R1E224K050BE)
C271  value 220nF  [CAPC100X50X55L25N]  (hidden comment: C1005X7R1E224K050BE)
C272  value 220nF  [CAPC100X50X55L25N]  (hidden comment: C1005X7R1E224K050BE)
C273  value 220nF  [CAPC100X50X55L25N]  (hidden comment: C1005X7R1E224K050BE)
C274  value 220nF  [CAPC100X50X55L25N]  (hidden comment: C1005X7R1E224K050BE)
C275  value 220nF  [CAPC100X50X55L25N]  (hidden comment: C1005X7R1E224K050BE)
C276  value 100nF  [CAPC100X50X55L25N]  (hidden comment: CC0402KRX7R8BB104)
C277  value 10uF  [CAPC200X125X145L45N]  (hidden comment: CL21B106KOQNNNE)
C278  value 220nF  [CAPC100X50X55L25N]  (hidden comment: C1005X7R1E224K050BE)
C279  value 220nF  [CAPC100X50X55L25N]  (hidden comment: C1005X7R1E224K050BE)
C280  value 220nF  [CAPC100X50X55L25N]  (hidden comment: C1005X7R1E224K050BE)
C281  value 220nF  [CAPC100X50X55L25N]  (hidden comment: C1005X7R1E224K050BE)
C282  value 1uF  [CAPC200X125X145L45N]  (hidden comment: TMK212B7105KG)
C283  value 10nF  [CAPC100X50X55L25N]  (hidden comment: GRM155R71H103KA88)
C284  value 10uF  [CAPC200X125X145L45N]  (hidden comment: CL21B106KOQNNNE)
C285  value 220nF  [CAPC100X50X55L25N]  (hidden comment: C1005X7R1E224K050BE)
C286  value 220nF  [CAPC100X50X55L25N]  (hidden comment: C1005X7R1E224K050BE)
C287  value 220nF  [CAPC100X50X55L25N]  (hidden comment: C1005X7R1E224K050BE)
C288  value 10uF  Voltage: 16V  Package: 0805  [CAPC2012X145N]  (hidden comment: EMK212BB7106MG)
C289  value 1uF  Voltage: 25V  Package: 0805  [CAPC200X125X145L45N]  (hidden comment: TMK212B7105KG)
C290  value 10nF  Voltage: 50V  Package: 0402  [CAPC100X50X55L25N]  (hidden comment: GRM155R71H103KA88)
C291  value 10uF  Voltage: 16V  Package: 0805  [CAPC2012X145N]  (hidden comment: EMK212BB7106MG)
C292  value 220nF  Voltage: 25V  Package: 0402  [CAPC100X50X55L25N]  (hidden comment: C1005X7R1E224K050BE)
L14  value 1k@100MHz  [1806]  (hidden comment: BLM41PG102SN1L)
L16  value 1k@100MHz  [1806]  (hidden comment: BLM41PG102SN1L)
L19  value 1k@100MHz  [1806]  (hidden comment: BLM41PG102SN1L)
U2  DAC3484IZAY  [ZAY-BGA-196]  (part D of 5)

### Nets
GND: C262.2 C263.2 C264.2 C265.2 C266.2 C267.2 C268.2 C269.2 C270.2 C271.2 C272.2 C273.2 C274.2 C275.2 C276.2 C277.2 C278.2 C279.2 C280.2 C281.2 C282.2 C283.2 C284.2 C285.2 C286.2 C287.2 C288.1 C289.1 C290.1 C291.1 C292.1
V1V2-A-DAC: C282.1 C283.1 L16.1 L19.1
V1V2-D-DAC: C277.1 C278.1 C279.1 C280.1 C281.1 U2.E5(DVDD) U2.E6(DVDD) U2.E7(DVDD) U2.F5(DVDD) U2.J5(DVDD) U2.K5(DVDD) U2.K6(DVDD) U2.K7(DVDD)
V3V3-DAC: C267.1 C268.1 C269.1 C270.1 C271.1 C272.1 C273.1 C274.1 C275.1 C276.1 L14.1 U2.C11(PLLAVDD) U2.D10(AVDD) U2.D11(PLLAVDD) U2.E11(AVDD) U2.F11(AVDD) U2.G11(AVDD) U2.H11(AVDD) U2.J11(AVDD) U2.K11(AVDD) U2.L10(AVDD)  [also labelled V3V3-DAC-PLL]
V1V2-A-DAC-CLK: C288.2 C289.2 C290.2 C291.2 C292.2 L19.2 U2.C12(CLKVDD)  [project net V1V2-A-DAC-CLK_27]
V1V2-A-DAC-DAC: C284.1 C285.1 C286.1 C287.1 L16.2 U2.D7(VFUSE) U2.D9(DACVDD) U2.E9(DACVDD) U2.E10(DACVDD) U2.F10(DACVDD) U2.G10(DACVDD) U2.H10(DACVDD) U2.J10(DACVDD) U2.K9(DACVDD) U2.K10(DACVDD) U2.L9(DACVDD)  [project net V1V2-A-DAC-DAC_27]
V3V3-DAC-IO: C262.1 C263.1 C264.1 C265.1 C266.1 L14.2 U2.D5(IOVDD) U2.D6(IOVDD) U2.G5(IOVDD) U2.H5(IOVDD) U2.L5(IOVDD) U2.L6(IOVDD)  [project net V3V3-DAC-IO_27]

Not connected (* = marked no-connect by the designer): U2 D12(LPF)*

### Notes on the sheet
- DAC Current (IOVDD+AVDD+PLL) = 135mA
- DAC Current (DACVDD) = 650mA
- DAC Current (DACVDD) = 50mA
- DAC Current (CLKVDD) = 100mA
- Title
- Engineer
- Revision
- Drawn By
- Checked By
- Date
- Sheet
- of
- (in symbol DAC3484IZAY, part D) 3.3V; 1.2V

### Library data of the parts
C262 C267 C277 C284 = LMK212B7106KG: Ceramic Capacitor 10uF ±10% 16V X7R 0805; Manufacturer: Samsung; Tr: -55:105; Manufacturer P/N: CL21B106KOQNNNE; Tolerance: ±10%; Package: 0805; Voltage: 16V
C263-C266 C268-C275 C278-C281 C285-C287 = TMK105B7224KV: Ceramic Capacitor 220nF ±10% 25V X7R 0402; Manufacturer: TDK; Manufacturer P/N: C1005X7R1E224K050BE; Tolerance: ±10%; Tr: *; Package: 0402; Voltage: 25V
C276 = TMK105B7104KV: Ceramic Capacitor 100nF ±10% 25V X7R 0402; Manufacturer: Yageo; Manufacturer P/N: TMK105B7104KV; Tolerance: ±10%; Tr: *; Package: 0402; Voltage: 25V
C282 = TMK212B7105KG: Ceramic Capacitor 1uF ±10% 25V X7R 0805; Manufacturer: Taiyo Yuden; Manufacturer P/N: TMK212B7105KG; Tolerance: ±10%; Tr: *; Package: 0805; Voltage: 25V
C283 = TMK105B7103KV: Ceramic Capacitor 10nF ±10% 50V X7R 0402; Manufacturer: Murata; Tr: -55:125; Manufacturer P/N: GRM155R71H103KA88; Tolerance: ±10%; Package: 0402; Voltage: 50V
C288 C291 = CAP 0603: Ceramic Capacitor 10uF ±20% 16V X7R 0805; Manufacturer: Taiyo Yuden; Tr: -55:125; Manufacturer P/N: EMK212BB7106MG; Tolerance: ±20%
C289 = CAP 0402: Ceramic Capacitor 1uF ±10% 25V X7R 0805; Manufacturer: Taiyo Yuden; Tr: -55:125; Manufacturer P/N: TMK212B7105KG; Tolerance: ±10%
C290 = CAP 0402: Ceramic Capacitor 10nF ±10% 50V X7R 0402; Manufacturer: Murata; Tr: -55:125; Manufacturer P/N: GRM155R71H103KA88; Tolerance: ±10%
C292 = CAP 0402: Ceramic Capacitor 220nF ±10% 25V X7R 0402; Manufacturer: TDK; Manufacturer P/N: C1005X7R1E224K050BE; Tolerance: ±10%
L14 L16 L19 = INDUCTANCE1: Ferrite Bead 1k@100MHz 1.5A 1806; Manufacturer: Murata; Tr: -55:125; Manufacturer P/N: BLM41PG102SN1L; Package: 1806
U2 = DAC3484IZAY: as U2 on sheet dac-digital; Manufacturer P/N: DAC3484IZAY

## Sheet dac-misc.SchDoc: DAC - Misc.
size Letter; CheckedBy: J. Brinton; CompanyName: Signal Laboratories, Inc.; DrawnBy: J. Brinton; Engineer: J. Brinton; Address1: 3479 Edison Way; Address2: Menlo Park CA 94025; Address3: +1 (877) 778-8435; Address4: siglabs.com; Revision: 3; SheetNumber: 29; SheetTotal: 49; ModifiedDate: 4/20/2018
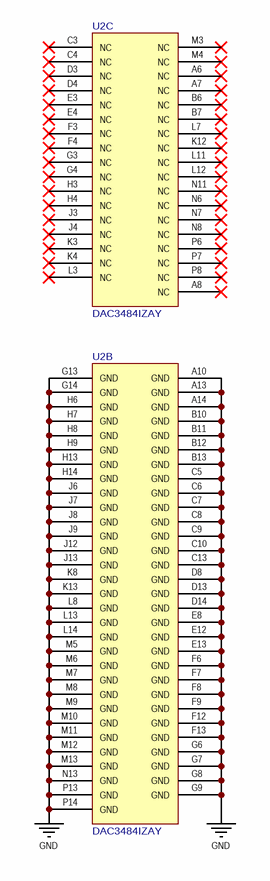
[diagram p12: dac-misc.SchDoc]

### Parts
U2  DAC3484IZAY  [ZAY-BGA-196]  (parts B,C of 5)

### Nets
GND: U2.A10(GND) U2.A13(GND) U2.A14(GND) U2.B10(GND) U2.B11(GND) U2.B12(GND) U2.B13(GND) U2.C5(GND) U2.C6(GND) U2.C7(GND) U2.C8(GND) U2.C9(GND) U2.C10(GND) U2.C13(GND) U2.D8(GND) U2.D13(GND) U2.D14(GND) U2.E8(GND) U2.E12(GND) U2.E13(GND) U2.F6(GND) U2.F7(GND) U2.F8(GND) U2.F9(GND) U2.F12(GND) U2.F13(GND) U2.G6(GND) U2.G7(GND) U2.G8(GND) U2.G9(GND) U2.G13(GND) U2.G14(GND) U2.H6(GND) U2.H7(GND) U2.H8(GND) U2.H9(GND) U2.H13(GND) U2.H14(GND) U2.J6(GND) U2.J7(GND) U2.J8(GND) U2.J9(GND) U2.J12(GND) U2.J13(GND) U2.K8(GND) U2.K13(GND) U2.L8(GND) U2.L13(GND) U2.L14(GND) U2.M5(GND) U2.M6(GND) U2.M7(GND) U2.M8(GND) U2.M9(GND) U2.M10(GND) U2.M11(GND) U2.M12(GND) U2.M13(GND) U2.N13(GND) U2.P13(GND) U2.P14(GND)

Not connected (* = marked no-connect by the designer): U2 A6(NC)* A7(NC)* A8(NC)* B6(NC)* B7(NC)* C3(NC)* C4(NC)* D3(NC)* D4(NC)* E3(NC)* E4(NC)* F3(NC)* F4(NC)* G3(NC)* G4(NC)* H3(NC)* H4(NC)* J3(NC)* J4(NC)* K3(NC)* K4(NC)* K12(NC)* L3(NC)* L7(NC)* L11(NC)* L12(NC)* M3(NC)* M4(NC)* N6(NC)* N7(NC)* N8(NC)* N11(NC)* P6(NC)* P7(NC)* P8(NC)*

### Notes on the sheet
- Title
- Engineer
- Revision
- Drawn By
- Checked By
- Date
- Sheet
- of

### Library data of the parts
U2 = DAC3484IZAY: as U2 on sheet dac-digital; Manufacturer P/N: DAC3484IZAY

## Sheet dac-ldo.SchDoc: DAC - LDOs
size Letter; CheckedBy: J. Brinton; CompanyName: Signal Laboratories, Inc.; DrawnBy: J. Brinton; Engineer: J. Brinton; Address1: 3479 Edison Way; Address2: Menlo Park CA 94025; Address3: +1 (877) 778-8435; Address4: siglabs.com; Revision: 3; SheetNumber: 28; SheetTotal: 49
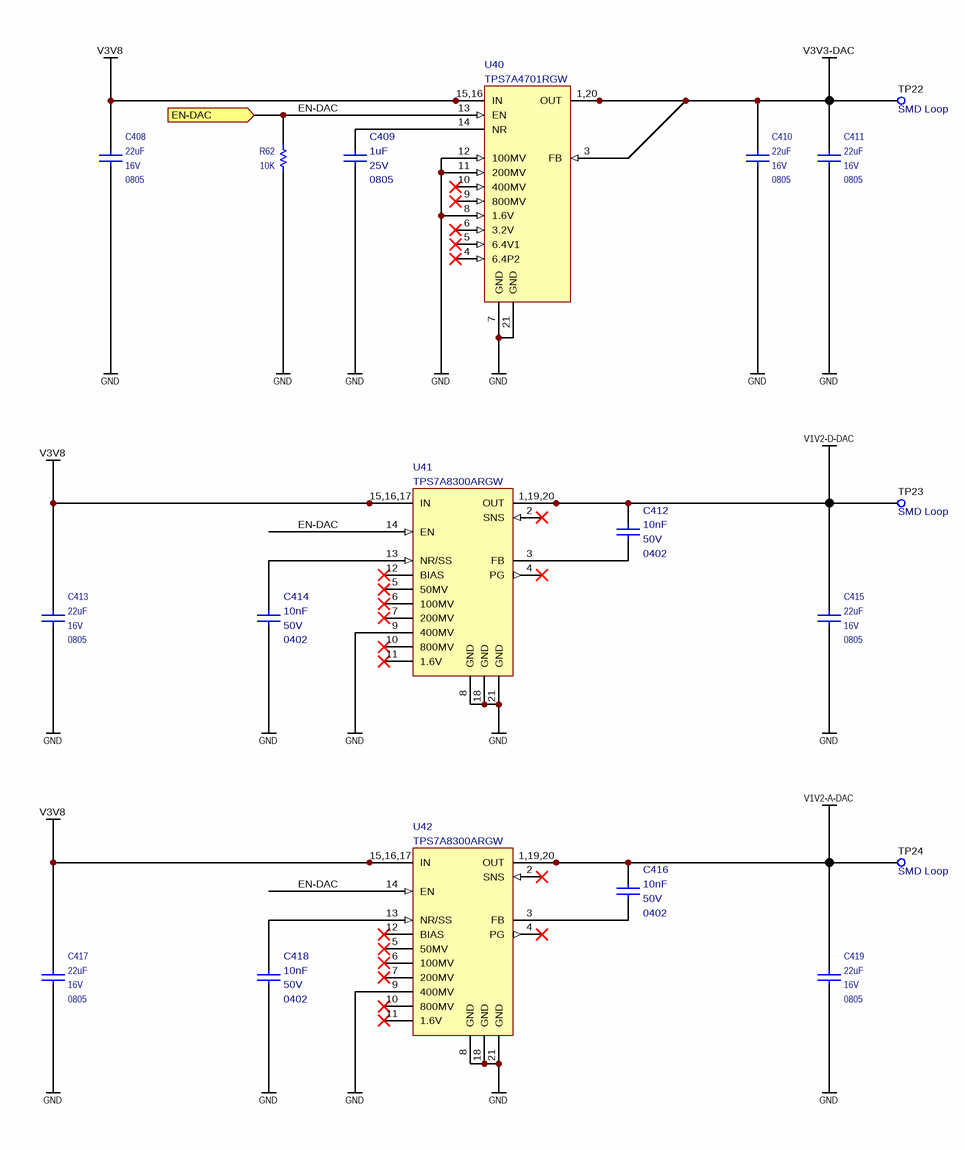
[diagram p13: dac-ldo.SchDoc]

### Parts
C408  value 22uF  Voltage: 16V  Package: 0805  [CAPC200X125X145L45N]  (hidden comment: CL21A226KOQNNNE)
C409  value 1uF  Package: 0805  Voltage: 25V  [CAPC200X125X145L45N]  (hidden comment: TMK212B7105KG)
C410  value 22uF  Voltage: 16V  Package: 0805  [CAPC200X125X145L45N]  (hidden comment: CL21A226KOQNNNE)
C411  value 22uF  Voltage: 16V  Package: 0805  [CAPC200X125X145L45N]  (hidden comment: CL21A226KOQNNNE)
C412  value 10nF  Package: 0402  Voltage: 50V  [CAPC100X50X55L25N]  (hidden comment: GRM155R71H103KA88)
C413  value 22uF  Voltage: 16V  Package: 0805  [CAPC200X125X145L45N]  (hidden comment: CL21A226KOQNNNE)
C414  value 10nF  Package: 0402  Voltage: 50V  [CAPC100X50X55L25N]  (hidden comment: GRM155R71H103KA88)
C415  value 22uF  Voltage: 16V  Package: 0805  [CAPC200X125X145L45N]  (hidden comment: CL21A226KOQNNNE)
C416  value 10nF  Package: 0402  Voltage: 50V  [CAPC100X50X55L25N]  (hidden comment: GRM155R71H103KA88)
C417  value 22uF  Voltage: 16V  Package: 0805  [CAPC200X125X145L45N]  (hidden comment: CL21A226KOQNNNE)
C418  value 10nF  Package: 0402  Voltage: 50V  [CAPC100X50X55L25N]  (hidden comment: GRM155R71H103KA88)
C419  value 22uF  Voltage: 16V  Package: 0805  [CAPC200X125X145L45N]  (hidden comment: CL21A226KOQNNNE)
R62  value 10K  [RESC1005X40N]  (hidden comment: ERJ-2RKF1002X)
TP22  Notes: SMD Loop  [5015]  (hidden comment: 5015)
TP23  Notes: SMD Loop  [5015]  (hidden comment: 5015)
TP24  Notes: SMD Loop  [5015]  (hidden comment: 5015)
U40  TPS7A4701RGW  [QFN65P500X500X100-21N]
U41  TPS7A8300ARGW  [QFN65P500X500X100-21N]
U42  TPS7A8300ARGW  [QFN65P500X500X100-21N]

### Ports
EN-DAC (in)

### Nets
GND: C408.1 C409.2 C410.1 C411.1 C413.1 C414.2 C415.1 C417.1 C418.2 C419.1 R62.2 U40.7(GND) U40.8(1.6V) U40.11(200MV) U40.12(100MV) U40.21(GND) U41.8(GND) U41.9(400MV) U41.18(GND) U41.21(GND) U42.8(GND) U42.9(400MV) U42.18(GND) U42.21(GND)
V1V2-A-DAC: C416.1 C419.2 TP24.1 U42.1(OUT) U42.19(OUT) U42.20(OUT)
V1V2-D-DAC: C412.1 C415.2 TP23.1 U41.1(OUT) U41.19(OUT) U41.20(OUT)
V3V3-DAC: C410.2 C411.2 TP22.1 U40.1(OUT) U40.3(FB) U40.20(OUT)
V3V8: C408.2 C413.2 C417.2 U40.15(IN) U40.16(IN) U41.15(IN) U41.16(IN) U41.17(IN) U42.15(IN) U42.16(IN) U42.17(IN)
EN-DAC: R62.1 U40.13(EN) U41.14(EN) U42.14(EN) ; port EN-DAC
NetC409_1: C409.1 U40.14(NR)
NetC412_2: C412.2 U41.3(FB)
NetC414_1: C414.1 U41.13(NR/SS)
NetC416_2: C416.2 U42.3(FB)
NetC418_1: C418.1 U42.13(NR/SS)

Not connected (* = marked no-connect by the designer): U40 4(6.4P2)* 5(6.4V1)* 6(3.2V)* 9(800MV)* 10(400MV)*; U41 2(SNS)* 4(PG)* 5(50MV)* 6(100MV)* 7(200MV)* 10(800MV)* 11(1.6V)* 12(BIAS)*; U42 2(SNS)* 4(PG)* 5(50MV)* 6(100MV)* 7(200MV)* 10(800MV)* 11(1.6V)* 12(BIAS)*

### Notes on the sheet
- Title
- Engineer
- Revision
- Drawn By
- Checked By
- Date
- Sheet
- of
- (in symbol TPS7A4701RGW_1) 15,16; 1,20
- (in symbol TPS7A8300ARGW) 15,16,17; 1,19,20

### Library data of the parts
C408 C410 C411 C413 C415 C417 C419 = CAP 0603: Ceramic Capacitor 22uF ±10% 16V X5R 0805; Manufacturer: Samsung; Tr: -55:85; Manufacturer P/N: CL21A226KOQNNNE; Tolerance: ±10%
C409 = TMK212B7105KG: as C282 on sheet dac-power; Manufacturer P/N: TMK212B7105KG; Tolerance: ±10%; Tr: *
C412 C414 C416 C418 = TMK105B7103KV: as C283 on sheet dac-power; Manufacturer P/N: GRM155R71H103KA88; Tolerance: ±10%
R62 = RES 0402: Thick Film Resistor 10k ±1% 0.1W 50V 0402; Manufacturer: Panasonic; Tr: -55:155; Package: 0402; Manufacturer P/N: ERJ-2RKF1002X; Tolerance: ±1%
TP22-TP24 = TEST_POINT_SMD_50: Test Point SMD; Manufacturer: Keystone; Manufacturer P/N: 5015
U40 = TPS7A4701RGW_1: Low-Dropout Linear Regulator 20-VQFN; Manufacturer: Texas Instruments; Manufacturer P/N: TPS7A4701RGW; Package: VQFN-20
U41 U42 = TPS7A8300ARGW: LDO Regulator, 2A, VQFN-20; Manufacturer: Texas Instruments; Package: VQFN-20; Manufacturer P/N: TPS7A8300ARGW

## Sheet adc.SchDoc: ADC
size Letter; CheckedBy: J. Brinton; CompanyName: Signal Laboratories, Inc.; DrawnBy: J. Brinton; Engineer: J. Brinton; Address1: 3479 Edison Way; Address2: Menlo Park CA 94025; Address3: +1 (877) 778-8435; Address4: siglabs.com; Revision: 3; SheetNumber: 18; SheetTotal: 49
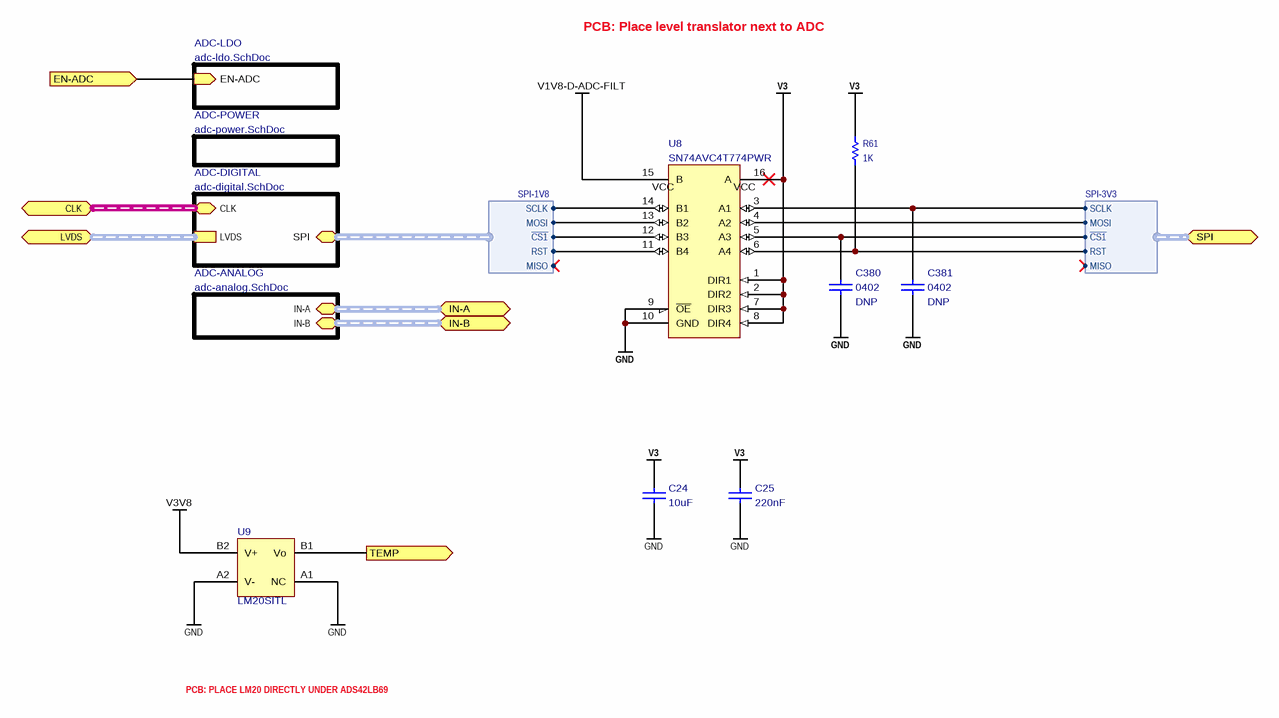
[diagram p14: adc.SchDoc]

### Parts
C24  value 10uF  [CAPC200X125X145L45N]  (hidden comment: CL21B106KOQNNNE)
C25  value 220nF  [CAPC100X50X55L25N]  (hidden comment: C1005X7R1E224K050BE)
C380  Package: 0402  Do Not Place: DNP  [CAPC100X50X55L25N]  (hidden comment: VJ0402A101KXA)
C381  Package: 0402  Do Not Place: DNP  [CAPC100X50X55L25N]  (hidden comment: VJ0402A101KXA)
R61  value 1K  [RESC1005X40N]  (hidden comment: RC0402FR-071KL)
U8  SN74AVC4T774PWR  [TSSOP16]
U9  LM20SITL  [YZR-4]

### Sub-sheets
ADC-ANALOG = adc-analog.SchDoc: IN-B (harness DIFF100), IN-A (harness DIFF100)
ADC-DIGITAL = adc-digital.SchDoc: LVDS (harness ADC-LVDS), CLK (harness CLK-LVPECL33-TERM), SPI (harness SPI-1V8)
ADC-LDO = adc-ldo.SchDoc: EN-ADC (in)
ADC-POWER = adc-power.SchDoc: no entries

### Ports
CLK (harness CLK-LVPECL33-TERM), EN-ADC (in), IN-A (harness DIFF100), IN-B (harness DIFF100), LVDS (harness ADC-LVDS), SPI (harness SPI-3V3), TEMP (out)

### Harnesses
SPI-1V8: MOSI, MISO, SCLK, ~{CS1}, RST
SPI-3V3: MOSI, MISO, SCLK, ~{CS1}, RST

### Nets
GND: C24.2 C25.2 C380.2 C381.2 U8.9(~{OE}) U8.10(GND) U9.A1(NC) U9.A2(V-)
V1V8-D-ADC-FILT: U8.15(B)
V3: C24.1 C25.1 R61.2 U8.1(DIR1) U8.2(DIR2) U8.7(DIR3) U8.8(DIR4) U8.16(A)
V3V8: U9.B2(V+)
EN-ADC: port EN-ADC, sheet ADC-LDO/EN-ADC
NetC380_1: C380.1 U8.5(A3) ; port SPI.~{CS1}
NetC381_1: C381.1 U8.3(A1) ; port SPI.SCLK
NetR61_1: R61.1 U8.6(A4) ; port SPI.RST
NetU8_4: U8.4(A2) ; port SPI.MOSI
NetU8_11: U8.11(B4) ; sheet ADC-DIGITAL/SPI.RST
NetU8_12: U8.12(B3) ; sheet ADC-DIGITAL/SPI.~{CS1}
NetU8_13: U8.13(B2) ; sheet ADC-DIGITAL/SPI.MOSI
NetU8_14: U8.14(B1) ; sheet ADC-DIGITAL/SPI.SCLK
NetU9_B1: U9.B1(Vo) ; port TEMP

### Buses and harness runs
harness port CLK = sheet ADC-DIGITAL/CLK
harness port IN-A = sheet ADC-ANALOG/IN-A
harness port IN-B = sheet ADC-ANALOG/IN-B
harness port LVDS = sheet ADC-DIGITAL/LVDS

### Notes on the sheet
- PCB: Place level translator next to ADC
- PCB: PLACE LM20 DIRECTLY UNDER ADS42LB69
- Title
- Engineer
- Revision
- Drawn By
- Checked By
- Date
- Sheet
- of
- (in symbol SN74AVC4T774PWR) VCC

### Library data of the parts
C24 = LMK212B7106KG: as C262 on sheet dac-power; Manufacturer P/N: CL21B106KOQNNNE; Tolerance: ±10%; Package: 0805; Voltage: 16V
C25 = TMK105B7224KV: as C263 on sheet dac-power; Manufacturer P/N: C1005X7R1E224K050BE; Tolerance: ±10%; Tr: *; Package: 0402; Voltage: 25V
C380 C381 = VJ0402A101JXA: as C483 on sheet dac-digital; Manufacturer P/N: VJ0402A101KXA; Tolerance: ±10%; Value: 100pF; Voltage: 50V
R61 = RES 0402: Thick Film Resistor 1k ±1% 0402; Manufacturer: Yageo; Tr: -55:155; Package: 0402; Manufacturer P/N: RC0402FR-071KL; Do Not Place: *; Tolerance: ±1%
U8 = SN74AVC4T774PWR: 4-Bit Dual-Supply Bus Transceiver; Manufacturer: Texas Instruments; Manufacturer P/N: SN74AVC4T774PWR
U9 = LM20SITL: Analog Temperature Sensor; Manufacturer: Texas Instruments; Manufacturer P/N: LM20SITL; Package: DSBGA-4

## Sheet adc-digital.SchDoc: ADC - Digital
size Letter; CheckedBy: J. Brinton; CompanyName: Signal Laboratories, Inc.; DrawnBy: J. Brinton; Engineer: J. Brinton; Address1: 3479 Edison Way; Address2: Menlo Park CA 94025; Address3: +1 (877) 778-8435; Address4: siglabs.com; Revision: 3; SheetNumber: 19; SheetTotal: 49
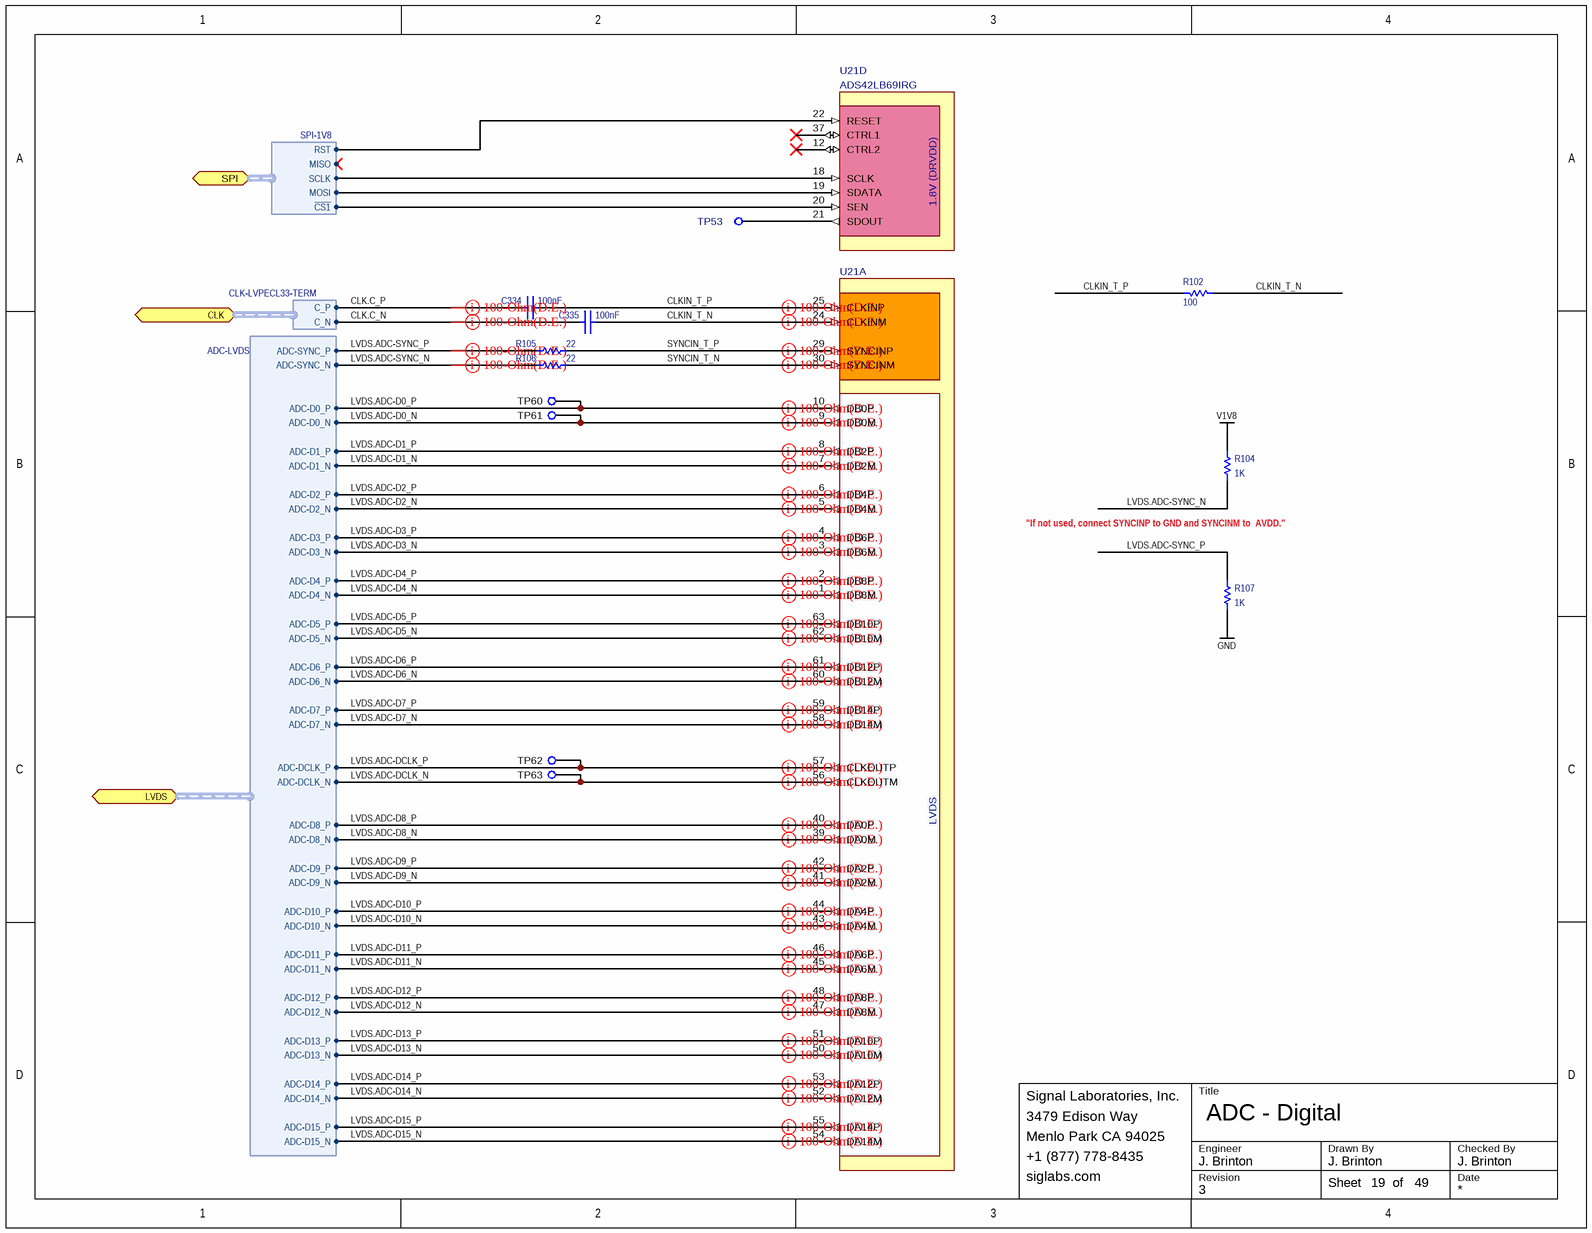
[diagram p15: adc-digital.SchDoc]

### Parts
C334  value 100nF  [CAPC100X50X55L25N]  (hidden comment: GRM155R71C104KA88J)
C335  value 100nF  [CAPC100X50X55L25N]  (hidden comment: GRM155R71C104KA88J)
R102  value 100  [RESC1005X40N]  (hidden comment: ERA-2AEB101X)
R104  value 1K  [RESC1005X40N]  (hidden comment: RC0402FR-071KL)
R105  value 22  [RESC1005X40N]  (hidden comment: RC0402FR-0722RL)
R106  value 22  [RESC1005X40N]  (hidden comment: RC0402FR-0722RL)
R107  value 1K  [RESC1005X40N]  (hidden comment: RC0402FR-071KL)
TP53  TEST_POINT_SMD_50  [TEST_POINT_SMD_10]  (value not drawn)  (no BOM)
TP60  TEST_POINT_SMD_50  [TEST_POINT_SMD_10]  (value not drawn)  (no BOM)
TP61  TEST_POINT_SMD_50  [TEST_POINT_SMD_10]  (value not drawn)  (no BOM)
TP62  TEST_POINT_SMD_50  [TEST_POINT_SMD_10]  (value not drawn)  (no BOM)
TP63  TEST_POINT_SMD_50  [TEST_POINT_SMD_10]  (value not drawn)  (no BOM)
U21  ADS42LB69IRG  [S-PVQFN-N64]  (value not drawn)  (parts A,D of 4)

### Ports
CLK (harness CLK-LVPECL33-TERM), LVDS (harness ADC-LVDS), SPI (harness SPI-1V8)

### Harnesses
ADC-LVDS: ADC-D0_P, ADC-D0_N, ADC-D1_P, ADC-D1_N, ADC-D2_P, ADC-D2_N, ADC-D3_P, ADC-D3_N, ADC-D4_P, ADC-D4_N, ADC-D5_P, ADC-D5_N, ADC-D6_P, ADC-D6_N, ADC-D7_P, ADC-D7_N, ADC-D8_P, ADC-D8_N, ADC-D9_P, ADC-D9_N, ADC-D10_P, ADC-D10_N, ADC-D11_P, ADC-D11_N, ADC-D12_P, ADC-D12_N, ADC-D13_P, ADC-D13_N, ADC-D14_P, ADC-D14_N, ADC-D15_P, ADC-D15_N, ADC-DCLK_P, ADC-DCLK_N, ADC-SYNC_P, ADC-SYNC_N
CLK-LVPECL33-TERM: C_P, C_N
SPI-1V8: MOSI, MISO, SCLK, ~{CS1}, RST

### Nets
GND: R107.1
V1V8: R104.2
CLK.C_N: C335.1 ; port CLK.C_N
CLK.C_P: C334.1 ; port CLK.C_P
CLKIN_T_N: C335.2 R102.2 U21.24(CLKINM)  [project net CLKIN_T_N_19]
CLKIN_T_P: C334.2 R102.1 U21.25(CLKINP)  [project net CLKIN_T_P_19]
LVDS.ADC-D0_N: TP61.1 U21.9(DB0M) ; port LVDS.ADC-D0_N
LVDS.ADC-D0_P: TP60.1 U21.10(DB0P) ; port LVDS.ADC-D0_P
LVDS.ADC-D1_N: U21.7(DB2M) ; port LVDS.ADC-D1_N
LVDS.ADC-D1_P: U21.8(DB2P) ; port LVDS.ADC-D1_P
LVDS.ADC-D2_N: U21.5(DB4M) ; port LVDS.ADC-D2_N
LVDS.ADC-D2_P: U21.6(DB4P) ; port LVDS.ADC-D2_P
LVDS.ADC-D3_N: U21.3(DB6M) ; port LVDS.ADC-D3_N
LVDS.ADC-D3_P: U21.4(DB6P) ; port LVDS.ADC-D3_P
LVDS.ADC-D4_N: U21.1(DB8M) ; port LVDS.ADC-D4_N
LVDS.ADC-D4_P: U21.2(DB8P) ; port LVDS.ADC-D4_P
LVDS.ADC-D5_N: U21.62(DB10M) ; port LVDS.ADC-D5_N
LVDS.ADC-D5_P: U21.63(DB10P) ; port LVDS.ADC-D5_P
LVDS.ADC-D6_N: U21.60(DB12M) ; port LVDS.ADC-D6_N
LVDS.ADC-D6_P: U21.61(DB12P) ; port LVDS.ADC-D6_P
LVDS.ADC-D7_N: U21.58(DB14M) ; port LVDS.ADC-D7_N
LVDS.ADC-D7_P: U21.59(DB14P) ; port LVDS.ADC-D7_P
LVDS.ADC-D8_N: U21.39(DA0M) ; port LVDS.ADC-D8_N
LVDS.ADC-D8_P: U21.40(DA0P) ; port LVDS.ADC-D8_P
LVDS.ADC-D9_N: U21.41(DA2M) ; port LVDS.ADC-D9_N
LVDS.ADC-D9_P: U21.42(DA2P) ; port LVDS.ADC-D9_P
LVDS.ADC-D10_N: U21.43(DA4M) ; port LVDS.ADC-D10_N
LVDS.ADC-D10_P: U21.44(DA4P) ; port LVDS.ADC-D10_P
LVDS.ADC-D11_N: U21.45(DA6M) ; port LVDS.ADC-D11_N
LVDS.ADC-D11_P: U21.46(DA6P) ; port LVDS.ADC-D11_P
LVDS.ADC-D12_N: U21.47(DA8M) ; port LVDS.ADC-D12_N
LVDS.ADC-D12_P: U21.48(DA8P) ; port LVDS.ADC-D12_P
LVDS.ADC-D13_N: U21.50(DA10M) ; port LVDS.ADC-D13_N
LVDS.ADC-D13_P: U21.51(DA10P) ; port LVDS.ADC-D13_P
LVDS.ADC-D14_N: U21.52(DA12M) ; port LVDS.ADC-D14_N
LVDS.ADC-D14_P: U21.53(DA12P) ; port LVDS.ADC-D14_P
LVDS.ADC-D15_N: U21.54(DA14M) ; port LVDS.ADC-D15_N
LVDS.ADC-D15_P: U21.55(DA14P) ; port LVDS.ADC-D15_P
LVDS.ADC-DCLK_N: TP63.1 U21.56(CLKOUTM) ; port LVDS.ADC-DCLK_N
LVDS.ADC-DCLK_P: TP62.1 U21.57(CLKOUTP) ; port LVDS.ADC-DCLK_P
LVDS.ADC-SYNC_N: R104.1 R106.1 ; port LVDS.ADC-SYNC_N
LVDS.ADC-SYNC_P: R105.1 R107.2 ; port LVDS.ADC-SYNC_P
SYNCIN_T_N: R106.2 U21.30(SYNCINM)  [project net SYNCIN_T_N_19]
SYNCIN_T_P: R105.2 U21.29(SYNCINP)  [project net SYNCIN_T_P_19]
NetTP53_1: TP53.1 U21.21(SDOUT)
NetU8_11: U21.22(RESET) ; port SPI.RST
NetU8_12: U21.20(SEN) ; port SPI.~{CS1}
NetU8_13: U21.19(SDATA) ; port SPI.MOSI
NetU8_14: U21.18(SCLK) ; port SPI.SCLK

Not connected (* = marked no-connect by the designer): U21 12(CTRL2)* 37(CTRL1)*

### Layout directives
differential pair; net class z100diff12; Name: 100-Ohm(D.E.): CLK.C_N, CLK.C_P, CLKIN_T_N_19, CLKIN_T_P_19, LVDS.ADC-D0_N, LVDS.ADC-D0_P, LVDS.ADC-D1_N, LVDS.ADC-D1_P, LVDS.ADC-D2_N, LVDS.ADC-D2_P, LVDS.ADC-D3_N, LVDS.ADC-D3_P, LVDS.ADC-D4_N, LVDS.ADC-D4_P, LVDS.ADC-D5_N, LVDS.ADC-D5_P, LVDS.ADC-D6_N, LVDS.ADC-D6_P, LVDS.ADC-D7_N, LVDS.ADC-D7_P, LVDS.ADC-D8_N, LVDS.ADC-D8_P, LVDS.ADC-D9_N, LVDS.ADC-D9_P, LVDS.ADC-D10_N, LVDS.ADC-D10_P, LVDS.ADC-D11_N, LVDS.ADC-D11_P, LVDS.ADC-D12_N, LVDS.ADC-D12_P, LVDS.ADC-D13_N, LVDS.ADC-D13_P, LVDS.ADC-D14_N, LVDS.ADC-D14_P, LVDS.ADC-D15_N, LVDS.ADC-D15_P, LVDS.ADC-DCLK_N, LVDS.ADC-DCLK_P, LVDS.ADC-SYNC_N, LVDS.ADC-SYNC_P, SYNCIN_T_N_19, SYNCIN_T_P_19

### Notes on the sheet
- "If not used, connect SYNCINP to GND and SYNCINM to  AVDD."
- Title
- Engineer
- Revision
- Drawn By
- Checked By
- Date
- Sheet
- of
- (in symbol ADS42LB69IRG, part A) LVDS
- (in symbol ADS42LB69IRG, part D) 1.8V (DRVDD)

### Library data of the parts
C334 C335 = CAP 0402: as C102 on sheet dac-analog; Voltage: 16V; Manufacturer P/N: GRM155R71C104KA88J; Package: 0402; Tolerance: ±10%
R102 = RES 0402: as R18 on sheet dac-digital; Package: 0402; Manufacturer P/N: ERA-2AEB101X; Do Not Place: *; Tolerance: ±0.1%
R104 R107 = RES 0402: as R61 on sheet adc; Package: 0402; Manufacturer P/N: RC0402FR-071KL; Do Not Place: *; Tolerance: ±1%
R105 R106 = RES 0402: Thick Film Resistor 22 ±1% 0402; Manufacturer: Yageo; Tr: -55:155; Package: 0402; Manufacturer P/N: RC0402FR-0722RL; Do Not Place: *; Tolerance: ±1%
TP53 TP60-TP63 = TEST_POINT_SMD_50: Test Point SMD
U21 = ADS42LB69IRG: Dual-Channel, 16-Bit, 250-MSPS Analog-to-Digital Converter; Manufacturer: Texas Instruments; Manufacturer P/N: ADS42LB69IRG